# EAGLE schematic olimex10 (EAGLE 6.6.0)

## Sheet 1 of 5
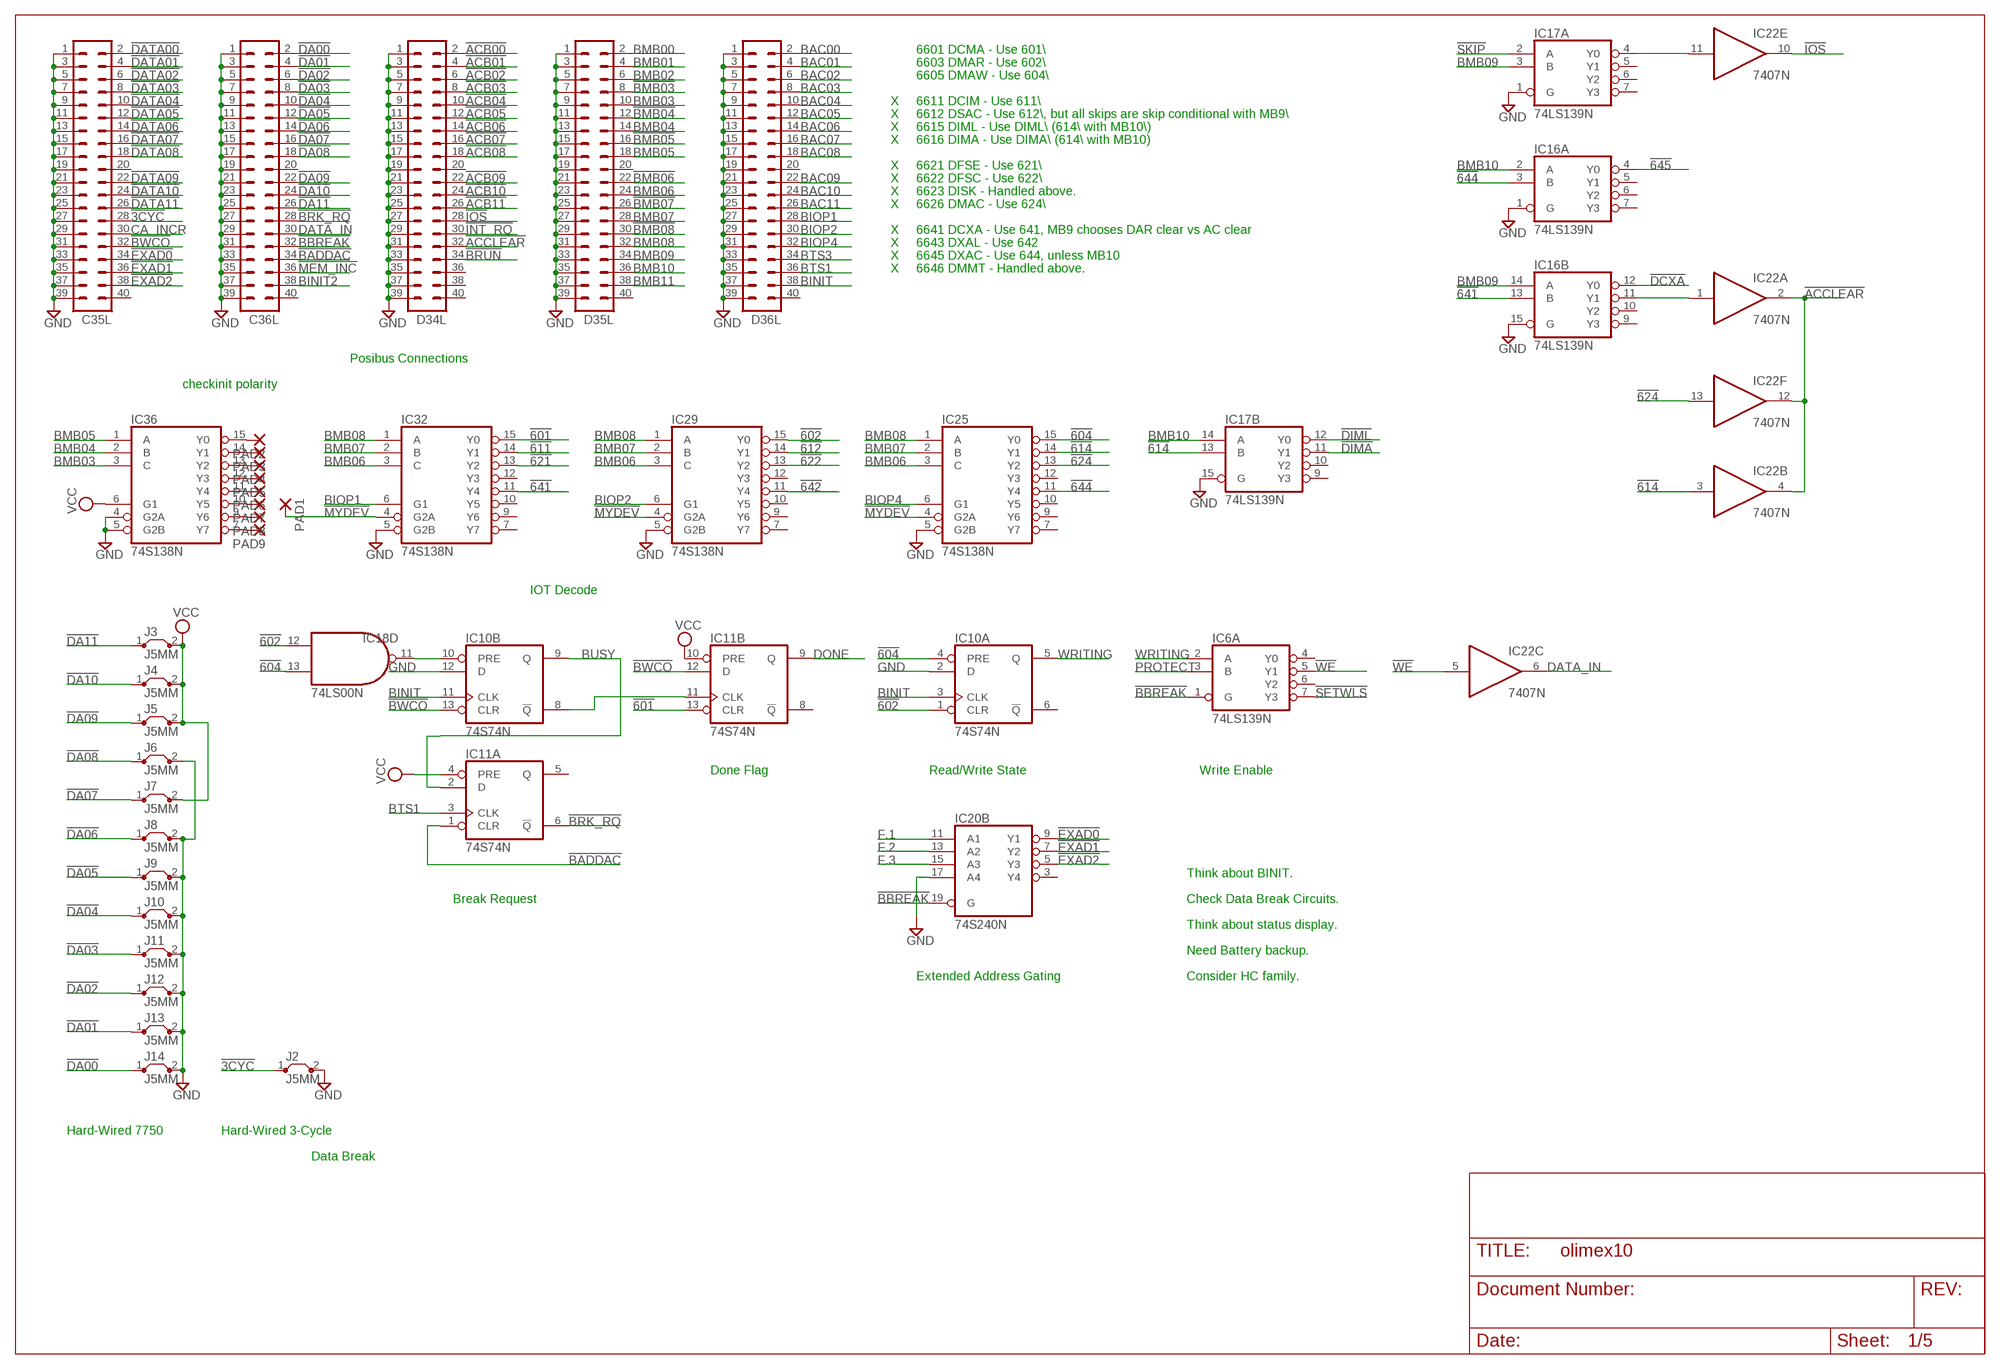
[diagram p0: schematic, sheet 1]

### Parts
C35L  MA20-2  [MA20-2]
C36L  MA20-2  [MA20-2]
D34L  MA20-2  [MA20-2]
D35L  MA20-2  [MA20-2]
D36L  MA20-2  [MA20-2]
IC6  74LS139N  74S139N  [DIL16]
IC10  74S74N  [DIL14]
IC11  74S74N  [DIL14]
IC16  74LS139N  74S139N  [DIL16]
IC17  74LS139N  74S139N  [DIL16]
IC18  74LS00N  [DIL14]
IC20  74S240N  [DIL20]
IC22  7407N  [DIL14]
IC25  74S138N  [DIL16]
IC29  74S138N  [DIL16]
IC32  74S138N  [DIL16]
IC36  74S138N  [DIL16]
J2  J5MM  [05]
J3  J5MM  [05]
J4  J5MM  [05]
J5  J5MM  [05]
J6  J5MM  [05]
J7  J5MM  [05]
J8  J5MM  [05]
J9  J5MM  [05]
J10  J5MM  [05]
J11  J5MM  [05]
J12  J5MM  [05]
J13  J5MM  [05]
J14  J5MM  [05]
PAD1  1,6/0,8  [1,6/0,8]
PAD2  1,6/0,8  [1,6/0,8]
PAD3  1,6/0,8  [1,6/0,8]
PAD4  1,6/0,8  [1,6/0,8]
PAD5  1,6/0,8  [1,6/0,8]
PAD6  1,6/0,8  [1,6/0,8]
PAD7  1,6/0,8  [1,6/0,8]
PAD8  1,6/0,8  [1,6/0,8]
PAD9  1,6/0,8  [1,6/0,8]

### Nets
!3CYC: C35L.28 J2.1
!601: IC11.13(B:CLR) IC32.15(Y0) ; also sheet 2
!602: IC10.1(A:CLR) IC18.12(D:I0) IC29.15(Y0) ; also sheet 2
!604: IC10.4(A:PRE) IC18.13(D:I1) IC25.15(Y0) ; also sheet 2
!611: IC32.14(Y1) ; also sheet 2
!612: IC29.14(Y1) ; also sheet 2
!614: IC17.13(B:B) IC22.3(B:I) IC25.14(Y1)
!621: IC32.13(Y2) ; also sheet 2
!622: IC29.13(Y2) ; also sheet 2
!624: IC22.13(F:I) IC25.13(Y2) ; also sheet 2
!641: IC16.13(B:B) IC32.11(Y4)
!642: IC29.11(Y4) ; also sheet 2
!644: IC16.3(A:B) IC25.11(Y4)
!645: IC16.4(A:Y0) ; also sheet 2
!ACB00: D34L.2 ; also sheet 2
!ACB01: D34L.4 ; also sheet 2
!ACB02: D34L.6 ; also sheet 2
!ACB03: D34L.8 ; also sheet 2
!ACB04: D34L.10 ; also sheet 2
!ACB05: D34L.12 ; also sheet 2
!ACB06: D34L.14 ; also sheet 2
!ACB07: D34L.16 ; also sheet 2
!ACB08: D34L.18 ; also sheet 2
!ACB09: D34L.22 ; also sheet 2
!ACB10: D34L.24 ; also sheet 2
!ACB11: D34L.26 ; also sheet 2
!ACCLEAR: D34L.32 IC22.2(A:O) IC22.4(B:O) IC22.12(F:O)
!BADDAC: C36L.34 IC11.1(A:CLR)
!BBREAK: C36L.32 IC6.1(A:G) IC20.19(B:G) ; also sheet 2,3
!BMB03: D35L.8
!BMB04: D35L.12
!BMB05: D35L.16
!BMB06: D35L.22
!BMB07: D35L.26
!BMB08: D35L.30
!BRK_RQ: C36L.28 IC11.6(A:!Q) ; also sheet 4,5
!BRUN: D34L.34
!BWCO: C35L.32 IC10.13(B:CLR) IC11.12(B:D) ; also sheet 4,5
!DA00: C36L.2 J14.1
!DA01: C36L.4 J13.1
!DA02: C36L.6 J12.1
!DA03: C36L.8 J11.1
!DA04: C36L.10 J10.1
!DA05: C36L.12 J9.1
!DA06: C36L.14 J8.1
!DA07: C36L.16 J7.1
!DA08: C36L.18 J6.1
!DA09: C36L.22 J5.1
!DA10: C36L.24 J4.1
!DA11: C36L.26 J3.1
!DATA00: C35L.2 ; also sheet 3
!DATA01: C35L.4 ; also sheet 3
!DATA02: C35L.6 ; also sheet 3
!DATA03: C35L.8 ; also sheet 3
!DATA04: C35L.10 ; also sheet 3
!DATA05: C35L.12 ; also sheet 3
!DATA06: C35L.14 ; also sheet 3
!DATA07: C35L.16 ; also sheet 3
!DATA08: C35L.18 ; also sheet 3
!DATA09: C35L.22 ; also sheet 3
!DATA10: C35L.24 ; also sheet 3
!DATA11: C35L.26 ; also sheet 3
!DCXA: IC16.12(B:Y0) ; also sheet 2
!DIMA: IC17.11(B:Y1) ; also sheet 2
!DIML: IC17.12(B:Y0) ; also sheet 2
!EXAD0: C35L.34 IC20.9(B:Y1)
!EXAD1: C35L.36 IC20.7(B:Y2)
!EXAD2: C35L.38 IC20.5(B:Y3)
!INT_RQ: D34L.30 ; also sheet 2
!IOS: D34L.28 IC22.10(E:O)
!MEM_INC: C36L.36
!MYDEV: IC25.4(G2A) IC29.4(G2A) IC32.4(G2A) PAD1.1(P)
!SETWLS: IC6.7(A:Y3) ; also sheet 2
!SKIP: IC17.2(A:A) ; also sheet 2
!WE: IC6.5(A:Y1) IC22.5(C:I) ; also sheet 3,4
BAC00: D36L.2 ; also sheet 2
BAC01: D36L.4 ; also sheet 2
BAC02: D36L.6 ; also sheet 2
BAC03: D36L.8 ; also sheet 2
BAC04: D36L.10 ; also sheet 2
BAC05: D36L.12 ; also sheet 2
BAC06: D36L.14 ; also sheet 2
BAC07: D36L.16 ; also sheet 2
BAC08: D36L.18 ; also sheet 2
BAC09: D36L.22 ; also sheet 2
BAC10: D36L.24 ; also sheet 2
BAC11: D36L.26 ; also sheet 2
BINIT: D36L.38 IC10.3(A:CLK) IC10.11(B:CLK) ; also sheet 2
BINIT2: C36L.38
BIOP1: D36L.28 IC32.6(G1)
BIOP2: D36L.30 IC29.6(G1)
BIOP4: D36L.32 IC25.6(G1)
BMB00: D35L.2 ; also sheet 3
BMB01: D35L.4 ; also sheet 3
BMB02: D35L.6 ; also sheet 3
BMB03: D35L.10 IC36.3(C) ; also sheet 3
BMB04: D35L.14 IC36.2(B) ; also sheet 3
BMB05: D35L.18 IC36.1(A) ; also sheet 3
BMB06: D35L.24 IC25.3(C) IC29.3(C) IC32.3(C) ; also sheet 3
BMB07: D35L.28 IC25.2(B) IC29.2(B) IC32.2(B) ; also sheet 3
BMB08: D35L.32 IC25.1(A) IC29.1(A) IC32.1(A) ; also sheet 3
BMB09: D35L.34 IC16.14(B:A) IC17.3(A:B) ; also sheet 3
BMB10: D35L.36 IC16.2(A:A) IC17.14(B:A) ; also sheet 3
BMB11: D35L.38 ; also sheet 3
BTS1: D36L.36 IC11.3(A:CLK)
BTS3: D36L.34
BUSY: IC10.9(B:Q) IC11.2(A:D) ; also sheet 2
CA_INCR: C35L.30
DATA_IN: C36L.30 IC22.6(C:O)
DONE: IC11.9(B:Q) ; also sheet 2,4,5
F.1: IC20.11(B:A1) ; also sheet 2,4,5
F.2: IC20.13(B:A2) ; also sheet 2,4,5
F.3: IC20.15(B:A3) ; also sheet 2,4,5
GND: C35L.1 C35L.3 C35L.5 C35L.7 C35L.9 C35L.11 C35L.13 C35L.15 C35L.17 C35L.19 C35L.21 C35L.23 C35L.25 C35L.27 C35L.29 C35L.31 C35L.33 C35L.35 C35L.37 C35L.39 C36L.1 C36L.3 C36L.5 C36L.7 C36L.9 C36L.11 C36L.13 C36L.15 C36L.17 C36L.19 C36L.21 C36L.23 C36L.25 C36L.27 C36L.29 C36L.31 C36L.33 C36L.35 C36L.37 C36L.39 D34L.1 D34L.3 D34L.5 D34L.7 D34L.9 D34L.11 D34L.13 D34L.15 D34L.17 D34L.19 D34L.21 D34L.23 D34L.25 D34L.27 D34L.29 D34L.31 D34L.33 D34L.35 D34L.37 D34L.39 D35L.1 D35L.3 D35L.5 D35L.7 D35L.9 D35L.11 D35L.13 D35L.15 D35L.17 D35L.19 D35L.21 D35L.23 D35L.25 D35L.27 D35L.29 D35L.31 D35L.33 D35L.35 D35L.37 D35L.39 D36L.1 D36L.3 D36L.5 D36L.7 D36L.9 D36L.11 D36L.13 D36L.15 D36L.17 D36L.19 D36L.21 D36L.23 D36L.25 D36L.27 D36L.29 D36L.31 D36L.33 D36L.35 D36L.37 D36L.39 IC10.2(A:D) IC10.12(B:D) IC16.1(A:G) IC16.15(B:G) IC17.1(A:G) IC17.15(B:G) IC20.17(B:A4) IC25.5(G2B) IC29.5(G2B) IC32.5(G2B) IC36.4(G2A) IC36.5(G2B) J2.2 J6.2 J8.2 J9.2 J10.2 J11.2 J12.2 J13.2 J14.2 ; also sheet 2,3,4,5
N$1: IC36.9(Y6) PAD8.1(P)
N$2: IC10.8(B:!Q) IC11.11(B:CLK)
N$5: IC36.15(Y0) PAD2.1(P)
N$6: IC36.14(Y1) PAD3.1(P)
N$7: IC36.13(Y2) PAD4.1(P)
N$8: IC36.12(Y3) PAD5.1(P)
N$9: IC36.11(Y4) PAD6.1(P)
N$10: IC36.10(Y5) PAD7.1(P)
N$11: IC36.7(Y7) PAD9.1(P)
N$26: IC16.11(B:Y1) IC22.1(A:I)
N$27: IC17.4(A:Y0) IC22.11(E:I)
N$31: IC10.10(B:PRE) IC18.11(D:O)
PROTECT: IC6.3(A:B) ; also sheet 3
VCC [Power]: IC11.4(A:PRE) IC11.10(B:PRE) IC36.6(G1) J3.2 J4.2 J5.2 J7.2 ; also sheet 2,3,4,5
WRITING: IC6.2(A:A) IC10.5(A:Q) ; also sheet 3,4,5
Unconnected: C35L.20 C35L.40 C36L.20 C36L.40 D34L.20 D34L.36 D34L.38 D34L.40 D35L.20 D35L.40 D36L.20 D36L.40 IC6.4(A:Y0) IC6.6(A:Y2) IC6.9(B:Y3) IC6.10(B:Y2) IC6.11(B:Y1) IC6.12(B:Y0) IC6.13(B:B) IC6.14(B:A) IC6.15(B:G) IC10.6(A:!Q) IC11.5(A:Q) IC11.8(B:!Q) IC16.5(A:Y1) IC16.6(A:Y2) IC16.7(A:Y3) IC16.9(B:Y3) IC16.10(B:Y2) IC17.5(A:Y1) IC17.6(A:Y2) IC17.7(A:Y3) IC17.9(B:Y3) IC17.10(B:Y2) IC20.1(A:G) IC20.2(A:A1) IC20.3(B:Y4) IC20.4(A:A2) IC20.6(A:A3) IC20.8(A:A4) IC20.12(A:Y4) IC20.14(A:Y3) IC20.16(A:Y2) IC20.18(A:Y1) IC22.8(D:O) IC22.9(D:I) IC25.7(Y7) IC25.9(Y6) IC25.10(Y5) IC25.12(Y3) IC29.7(Y7) IC29.9(Y6) IC29.10(Y5) IC29.12(Y3) IC32.7(Y7) IC32.9(Y6) IC32.10(Y5) IC32.12(Y3)

### Notes on the sheet
- 6601 DCMA - Use 601\\
- 6603 DMAR - Use 602\\
- 6605 DMAW - Use 604\\
- X | 6611 DCIM - Use 611\\
- X | 6612 DSAC - Use 612\\, but all skips are skip conditional with MB9\\
- X | 6615 DIML - Use DIML\\ (614\\ with MB10\\)
- X | 6616 DIMA - Use DIMA\\ (614\\ with MB10)
- X | 6621 DFSE - Use 621\\
- X | 6622 DFSC - Use 622\\
- X | 6623 DISK - Handled above.
- X | 6626 DMAC - Use 624\\
- X | 6641 DCXA - Use 641, MB9 chooses DAR clear vs AC clear
- X | 6643 DXAL - Use 642
- X | 6645 DXAC - Use 644, unless MB10
- X | 6646 DMMT - Handled above.
- Posibus Connections
- checkinit polarity
- IOT Decode
- Done Flag | Read/Write State | Write Enable
- Think about BINIT.
- Break Request | Check Data Break Circuits.
- Think about status display.
- Need Battery backup.
- Extended Address Gating | Consider HC family.
- Hard-Wired 7750 | Hard-Wired 3-Cycle
- Data Break

## Sheet 2 of 5
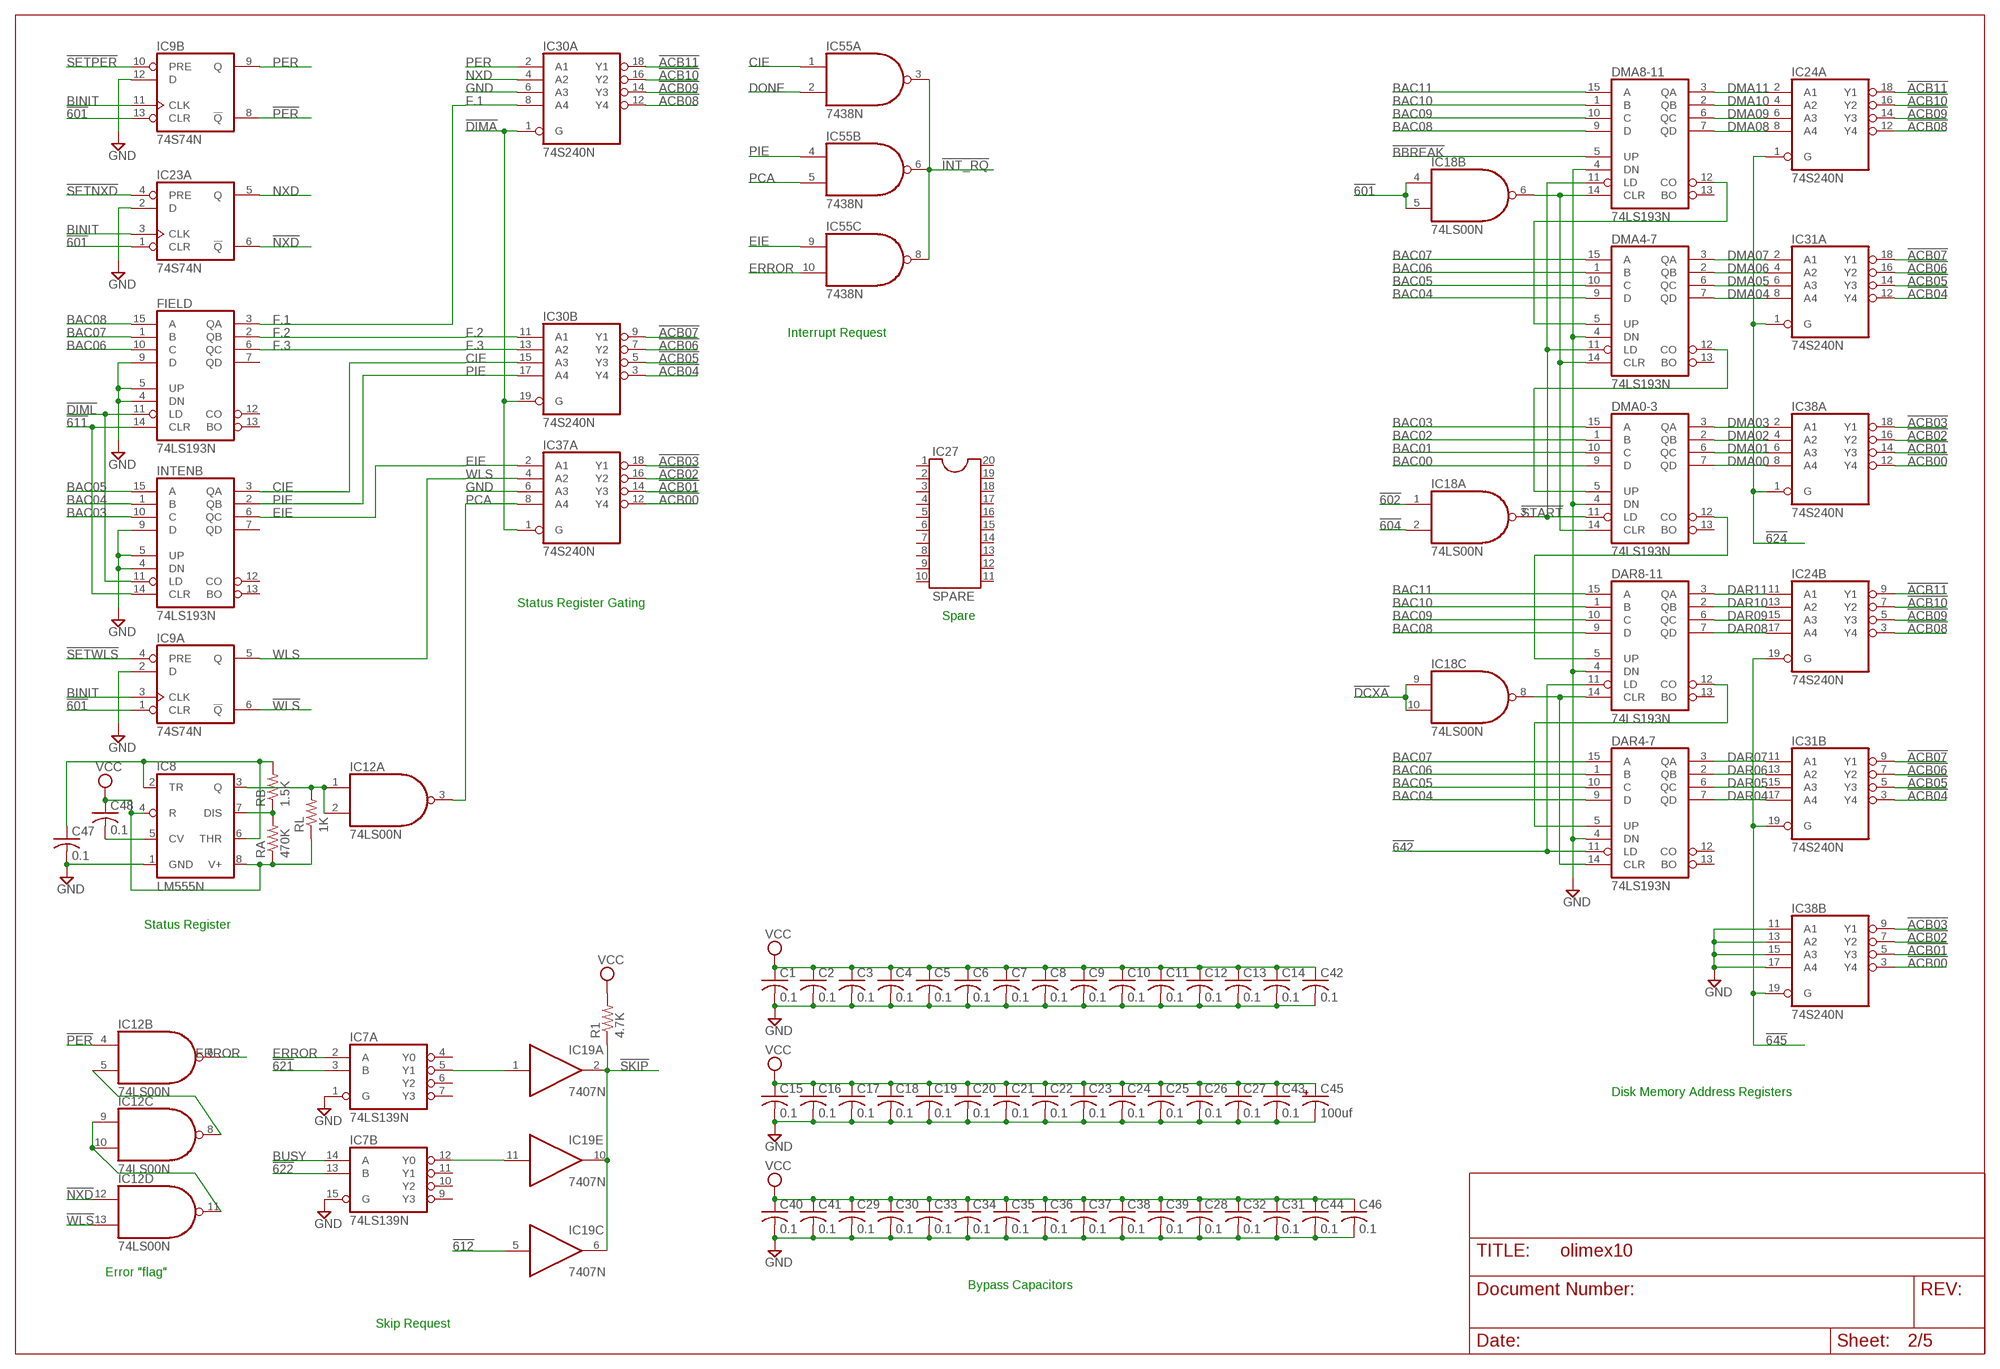
[diagram p1: schematic, sheet 2]

### Parts
C1  0.1  C-US050-025X075  [C050-025X075]
C2  0.1  C-US050-025X075  [C050-025X075]
C3  0.1  C-US050-025X075  [C050-025X075]
C4  0.1  C-US050-025X075  [C050-025X075]
C5  0.1  C-US050-025X075  [C050-025X075]
C6  0.1  C-US050-025X075  [C050-025X075]
C7  0.1  C-US050-025X075  [C050-025X075]
C8  0.1  C-US050-025X075  [C050-025X075]
C9  0.1  C-US050-025X075  [C050-025X075]
C10  0.1  C-US050-025X075  [C050-025X075]
C11  0.1  C-US050-025X075  [C050-025X075]
C12  0.1  C-US050-025X075  [C050-025X075]
C13  0.1  C-US050-025X075  [C050-025X075]
C14  0.1  C-US050-025X075  [C050-025X075]
C15  0.1  C-US050-025X075  [C050-025X075]
C16  0.1  C-US050-025X075  [C050-025X075]
C17  0.1  C-US050-025X075  [C050-025X075]
C18  0.1  C-US050-025X075  [C050-025X075]
C19  0.1  C-US050-025X075  [C050-025X075]
C20  0.1  C-US050-025X075  [C050-025X075]
C21  0.1  C-US050-025X075  [C050-025X075]
C22  0.1  C-US050-025X075  [C050-025X075]
C23  0.1  C-US050-025X075  [C050-025X075]
C24  0.1  C-US050-025X075  [C050-025X075]
C25  0.1  C-US050-025X075  [C050-025X075]
C26  0.1  C-US050-025X075  [C050-025X075]
C27  0.1  C-US050-025X075  [C050-025X075]
C28  0.1  C-US050-025X075  [C050-025X075]
C29  0.1  C-US050-025X075  [C050-025X075]
C30  0.1  C-US050-025X075  [C050-025X075]
C31  0.1  C-US050-025X075  [C050-025X075]
C32  0.1  C-US050-025X075  [C050-025X075]
C33  0.1  C-US050-025X075  [C050-025X075]
C34  0.1  C-US050-025X075  [C050-025X075]
C35  0.1  C-US050-025X075  [C050-025X075]
C36  0.1  C-US050-025X075  [C050-025X075]
C37  0.1  C-US050-025X075  [C050-025X075]
C38  0.1  C-US050-025X075  [C050-025X075]
C39  0.1  C-US050-025X075  [C050-025X075]
C40  0.1  C-US050-025X075  [C050-025X075]
C41  0.1  C-US050-025X075  [C050-025X075]
C42  0.1  C-US050-025X075  [C050-025X075]
C43  0.1  C-US050-025X075  [C050-025X075]
C44  0.1  C-US050-025X075  [C050-025X075]
C45  100uf  CPOL-USE22-6AXIAL  [E22-6]
C46  0.1  C-US050-025X075  [C050-025X075]
C47  0.1  C-US050-025X075  [C050-025X075]
C48  0.1  C-US050-025X075  [C050-025X075]
DAR4-7  74LS193N  74LS192N  [DIL16]
DAR8-11  74LS193N  74LS192N  [DIL16]
DMA0-3  74LS193N  74LS192N  [DIL16]
DMA4-7  74LS193N  74LS192N  [DIL16]
DMA8-11  74LS193N  74LS192N  [DIL16]
FIELD  74LS193N  74LS192N  [DIL16]
IC7  74LS139N  [DIL16]
IC8  LM555N  [DIL08]
IC9  74S74N  [DIL14]
IC12  74LS00N  [DIL14]
IC19  7407N  [DIL14]
IC23  74S74N  [DIL14]
IC24  74S240N  [DIL20]
IC27  SPARE  DIL20  [DIL20]
IC30  74S240N  [DIL20]
IC31  74S240N  [DIL20]
IC37  74S240N  [DIL20]
IC38  74S240N  [DIL20]
IC55  7438N  [DIL14]
INTENB  74LS193N  74LS192N  [DIL16]
R1  4.7K  R-US_0207/10  [0207/10]
RA  470K  R-US_0207/10  [0207/10]
RB  1.5K  R-US_0207/10  [0207/10]
RL  1K  R-US_0207/10  [0207/10]

### Nets
!601: IC9.1(A:CLR) IC9.13(B:CLR) IC18.4(B:I0) IC18.5(B:I1) IC23.1(A:CLR) ; also sheet 1
!602: IC18.1(A:I0) ; also sheet 1
!604: IC18.2(A:I1) ; also sheet 1
!611: FIELD.14(CLR) INTENB.14(CLR) ; also sheet 1
!612: IC19.5(C:I) ; also sheet 1
!621: IC7.3(A:B) ; also sheet 1
!622: IC7.13(B:B) ; also sheet 1
!624: IC24.1(A:G) IC31.1(A:G) IC38.1(A:G) ; also sheet 1
!642: DAR4-7.11(LD) DAR8-11.11(LD) ; also sheet 1
!645: IC24.19(B:G) IC31.19(B:G) IC38.19(B:G) ; also sheet 1
!ACB00: IC37.12(A:Y4) IC38.3(B:Y4) IC38.12(A:Y4) ; also sheet 1
!ACB01: IC37.14(A:Y3) IC38.5(B:Y3) IC38.14(A:Y3) ; also sheet 1
!ACB02: IC37.16(A:Y2) IC38.7(B:Y2) IC38.16(A:Y2) ; also sheet 1
!ACB03: IC37.18(A:Y1) IC38.9(B:Y1) IC38.18(A:Y1) ; also sheet 1
!ACB04: IC30.3(B:Y4) IC31.3(B:Y4) IC31.12(A:Y4) ; also sheet 1
!ACB05: IC30.5(B:Y3) IC31.5(B:Y3) IC31.14(A:Y3) ; also sheet 1
!ACB06: IC30.7(B:Y2) IC31.7(B:Y2) IC31.16(A:Y2) ; also sheet 1
!ACB07: IC30.9(B:Y1) IC31.9(B:Y1) IC31.18(A:Y1) ; also sheet 1
!ACB08: IC24.3(B:Y4) IC24.12(A:Y4) IC30.12(A:Y4) ; also sheet 1
!ACB09: IC24.5(B:Y3) IC24.14(A:Y3) IC30.14(A:Y3) ; also sheet 1
!ACB10: IC24.7(B:Y2) IC24.16(A:Y2) IC30.16(A:Y2) ; also sheet 1
!ACB11: IC24.9(B:Y1) IC24.18(A:Y1) IC30.18(A:Y1) ; also sheet 1
!BBREAK: DMA8-11.5(UP) ; also sheet 1,3
!DCXA: IC18.9(C:I0) IC18.10(C:I1) ; also sheet 1
!DIMA: IC30.1(A:G) IC30.19(B:G) IC37.1(A:G) ; also sheet 1
!DIML: FIELD.11(LD) INTENB.11(LD) ; also sheet 1
!INT_RQ: IC55.3(A:O) IC55.6(B:O) IC55.8(C:O) ; also sheet 1
!NXD: IC12.12(D:I0) IC23.6(A:!Q)
!PER: IC9.8(B:!Q) IC12.4(B:I0)
!SETNXD: IC23.4(A:PRE) ; also sheet 3
!SETPER: IC9.10(B:PRE) ; also sheet 3
!SETWLS: IC9.4(A:PRE) ; also sheet 1
!SKIP: IC19.2(A:O) IC19.6(C:O) IC19.10(E:O) R1.1 ; also sheet 1
!START: DMA0-3.11(LD) DMA4-7.11(LD) DMA8-11.11(LD) IC18.3(A:O)
!WLS: IC9.6(A:!Q) IC12.13(D:I1)
BAC00: DMA0-3.9(D) ; also sheet 1
BAC01: DMA0-3.10(C) ; also sheet 1
BAC02: DMA0-3.1(B) ; also sheet 1
BAC03: DMA0-3.15(A) INTENB.10(C) ; also sheet 1
BAC04: DAR4-7.9(D) DMA4-7.9(D) INTENB.1(B) ; also sheet 1
BAC05: DAR4-7.10(C) DMA4-7.10(C) INTENB.15(A) ; also sheet 1
BAC06: DAR4-7.1(B) DMA4-7.1(B) FIELD.10(C) ; also sheet 1
BAC07: DAR4-7.15(A) DMA4-7.15(A) FIELD.1(B) ; also sheet 1
BAC08: DAR8-11.9(D) DMA8-11.9(D) FIELD.15(A) ; also sheet 1
BAC09: DAR8-11.10(C) DMA8-11.10(C) ; also sheet 1
BAC10: DAR8-11.1(B) DMA8-11.1(B) ; also sheet 1
BAC11: DAR8-11.15(A) DMA8-11.15(A) ; also sheet 1
BINIT: IC9.3(A:CLK) IC9.11(B:CLK) IC23.3(A:CLK) ; also sheet 1
BUSY: IC7.14(B:A) ; also sheet 1
CIE: IC30.15(B:A3) IC55.1(A:I0) INTENB.3(QA) ; also sheet 4,5
DAR04: DAR4-7.7(QD) IC31.17(B:A4) ; also sheet 3,4,5
DAR05: DAR4-7.6(QC) IC31.15(B:A3) ; also sheet 3,4,5
DAR06: DAR4-7.2(QB) IC31.13(B:A2) ; also sheet 3,4,5
DAR07: DAR4-7.3(QA) IC31.11(B:A1) ; also sheet 3,4,5
DAR08: DAR8-11.7(QD) IC24.17(B:A4) ; also sheet 3,4,5
DAR09: DAR8-11.6(QC) IC24.15(B:A3) ; also sheet 3,4,5
DAR10: DAR8-11.2(QB) IC24.13(B:A2) ; also sheet 3,4,5
DAR11: DAR8-11.3(QA) IC24.11(B:A1) ; also sheet 3,4,5
DMA00: DMA0-3.7(QD) IC38.8(A:A4) ; also sheet 3,4,5
DMA01: DMA0-3.6(QC) IC38.6(A:A3) ; also sheet 3,4,5
DMA02: DMA0-3.2(QB) IC38.4(A:A2) ; also sheet 3,4,5
DMA03: DMA0-3.3(QA) IC38.2(A:A1) ; also sheet 3,4,5
DMA04: DMA4-7.7(QD) IC31.8(A:A4) ; also sheet 3,4,5
DMA05: DMA4-7.6(QC) IC31.6(A:A3) ; also sheet 3,4,5
DMA06: DMA4-7.2(QB) IC31.4(A:A2) ; also sheet 3,4,5
DMA07: DMA4-7.3(QA) IC31.2(A:A1) ; also sheet 3,4,5
DMA08: DMA8-11.7(QD) IC24.8(A:A4) ; also sheet 3,4,5
DMA09: DMA8-11.6(QC) IC24.6(A:A3) ; also sheet 3,4,5
DMA10: DMA8-11.2(QB) IC24.4(A:A2) ; also sheet 3,4,5
DMA11: DMA8-11.3(QA) IC24.2(A:A1) ; also sheet 3,4,5
DONE: IC55.2(A:I1) ; also sheet 1,4,5
EIE: IC37.2(A:A1) IC55.9(C:I0) INTENB.6(QC) ; also sheet 4,5
ERROR: IC7.2(A:A) IC12.6(B:O) IC55.10(C:I1)
F.1: FIELD.3(QA) IC30.8(A:A4) ; also sheet 1,4,5
F.2: FIELD.2(QB) IC30.11(B:A1) ; also sheet 1,4,5
F.3: FIELD.6(QC) IC30.13(B:A2) ; also sheet 1,4,5
GND: C1.2 C2.2 C3.2 C4.2 C5.2 C6.2 C7.2 C8.2 C9.2 C10.2 C11.2 C12.2 C13.2 C14.2 C15.2 C16.2 C17.2 C18.2 C19.2 C20.2 C21.2 C22.2 C23.2 C24.2 C25.2 C26.2 C27.2 C28.2 C29.2 C30.2 C31.2 C32.2 C33.2 C34.2 C35.2 C36.2 C37.2 C38.2 C39.2 C40.2 C41.2 C42.2 C43.2 C44.2 C45.- C46.2 C47.2 DAR4-7.4(DN) DAR8-11.4(DN) DMA0-3.4(DN) DMA4-7.4(DN) DMA8-11.4(DN) FIELD.4(DN) FIELD.5(UP) FIELD.9(D) IC7.1(A:G) IC7.15(B:G) IC8.1(GND) IC9.2(A:D) IC9.12(B:D) IC23.2(A:D) IC30.6(A:A3) IC37.6(A:A3) IC38.11(B:A1) IC38.13(B:A2) IC38.15(B:A3) IC38.17(B:A4) INTENB.4(DN) INTENB.5(UP) INTENB.9(D) ; also sheet 1,3,4,5
N$3: DMA0-3.5(UP) DMA4-7.12(CO)
N$12: DAR4-7.14(CLR) DAR8-11.14(CLR) IC18.8(C:O)
N$13: DMA4-7.5(UP) DMA8-11.12(CO)
N$16: DAR8-11.5(UP) DMA0-3.12(CO)
N$22: DMA0-3.14(CLR) DMA4-7.14(CLR) DMA8-11.14(CLR) IC18.6(B:O)
N$25: DAR4-7.5(UP) DAR8-11.12(CO)
N$28: IC7.5(A:Y1) IC19.1(A:I)
N$29: IC8.7(DIS) RA.2 RB.1
N$30: IC8.3(Q) IC12.1(A:I0) IC12.2(A:I1) RL.2
N$32: C47.1 IC8.2(TR) IC8.6(THR) RB.2
N$33: IC7.12(B:Y0) IC19.11(E:I)
N$34: C48.2 IC8.5(CV)
N$37: IC12.9(C:I0) IC12.10(C:I1) IC12.11(D:O)
N$40: IC12.5(B:I1) IC12.8(C:O)
NXD: IC23.5(A:Q) IC30.4(A:A2) ; also sheet 4,5
PCA: IC12.3(A:O) IC37.8(A:A4) IC55.5(B:I1)
PER: IC9.9(B:Q) IC30.2(A:A1) ; also sheet 4,5
PIE: IC30.17(B:A4) IC55.4(B:I0) INTENB.2(QB) ; also sheet 4,5
VCC [Power]: C1.1 C2.1 C3.1 C4.1 C5.1 C6.1 C7.1 C8.1 C9.1 C10.1 C11.1 C12.1 C13.1 C14.1 C15.1 C16.1 C17.1 C18.1 C19.1 C20.1 C21.1 C22.1 C23.1 C24.1 C25.1 C26.1 C27.1 C28.1 C29.1 C30.1 C31.1 C32.1 C33.1 C34.1 C35.1 C36.1 C37.1 C38.1 C39.1 C40.1 C41.1 C42.1 C43.1 C44.1 C45.+ C46.1 C48.1 IC8.4(R) IC8.8(V+) R1.2 RA.1 RL.1 ; also sheet 1,3,4,5
WLS: IC9.5(A:Q) IC37.4(A:A2) ; also sheet 4,5
Unconnected: DAR4-7.12(CO) DAR4-7.13(BO) DAR8-11.13(BO) DMA0-3.13(BO) DMA4-7.13(BO) DMA8-11.13(BO) FIELD.7(QD) FIELD.12(CO) FIELD.13(BO) IC7.4(A:Y0) IC7.6(A:Y2) IC7.7(A:Y3) IC7.9(B:Y3) IC7.10(B:Y2) IC7.11(B:Y1) IC19.3(B:I) IC19.4(B:O) IC19.8(D:O) IC19.9(D:I) IC19.12(F:O) IC19.13(F:I) IC23.8(B:!Q) IC23.9(B:Q) IC23.10(B:PRE) IC23.11(B:CLK) IC23.12(B:D) IC23.13(B:CLR) IC27.1 IC27.2 IC27.3 IC27.4 IC27.5 IC27.6 IC27.7 IC27.8 IC27.9 IC27.10 IC27.11 IC27.12 IC27.13 IC27.14 IC27.15 IC27.16 IC27.17 IC27.18 IC27.19 IC27.20 IC37.3(B:Y4) IC37.5(B:Y3) IC37.7(B:Y2) IC37.9(B:Y1) IC37.11(B:A1) IC37.13(B:A2) IC37.15(B:A3) IC37.17(B:A4) IC37.19(B:G) IC55.11(D:O) IC55.12(D:I0) IC55.13(D:I1) INTENB.7(QD) INTENB.12(CO) INTENB.13(BO)

### Notes on the sheet
- Interrupt Request
- Status Register Gating
- Spare
- Status Register
- Disk Memory Address Registers
- Error "flag"
- Bypass Capacitors
- Skip Request

## Sheet 3 of 5
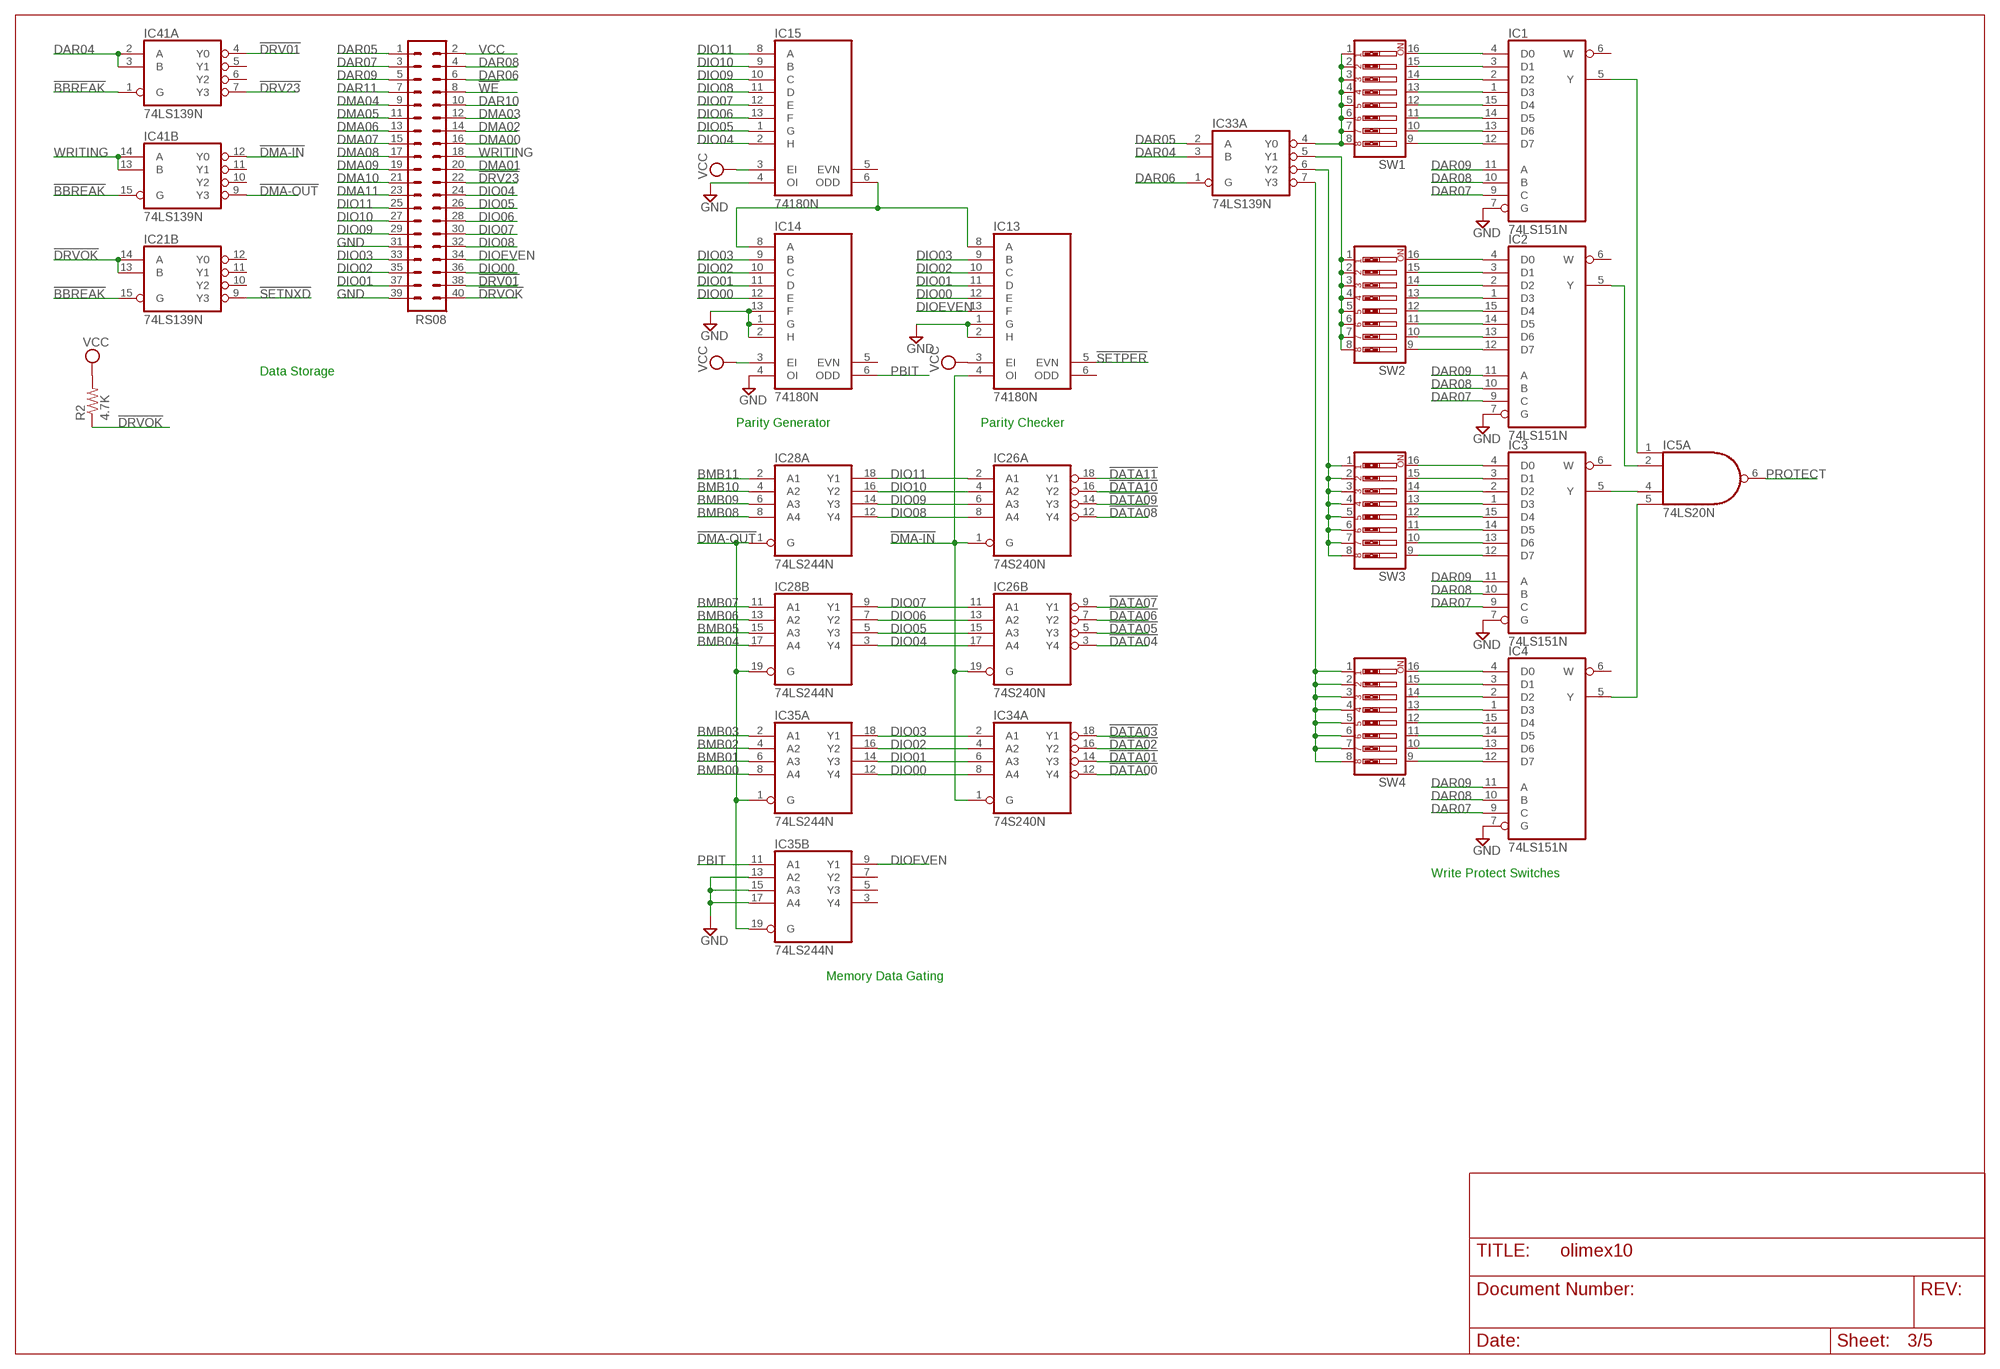
[diagram p2: schematic, sheet 3]

### Parts
IC1  74LS151N  [DIL16]
IC2  74LS151N  [DIL16]
IC3  74LS151N  [DIL16]
IC4  74LS151N  [DIL16]
IC5  74LS20N  [DIL14]
IC13  74180N  [DIL14]
IC14  74180N  [DIL14]
IC15  74180N  [DIL14]
IC21  74LS139N  [DIL16]
IC26  74S240N  [DIL20]
IC28  74LS244N  [DIL20]
IC33  74LS139N  [DIL16]
IC34  74S240N  [DIL20]
IC35  74LS244N  [DIL20]
IC41  74LS139N  [DIL16]
R2  4.7K  R-US_0207/10  [0207/10]
RS08  MA20-2  [MA20-2]
SW1  SW_DIP-8  [EDG-08]
SW2  SW_DIP-8  [EDG-08]
SW3  SW_DIP-8  [EDG-08]
SW4  SW_DIP-8  [EDG-08]

### Nets
!BBREAK: IC21.15(B:G) IC41.1(A:G) IC41.15(B:G) ; also sheet 1,2
!DATA00: IC34.12(A:Y4) ; also sheet 1
!DATA01: IC34.14(A:Y3) ; also sheet 1
!DATA02: IC34.16(A:Y2) ; also sheet 1
!DATA03: IC34.18(A:Y1) ; also sheet 1
!DATA04: IC26.3(B:Y4) ; also sheet 1
!DATA05: IC26.5(B:Y3) ; also sheet 1
!DATA06: IC26.7(B:Y2) ; also sheet 1
!DATA07: IC26.9(B:Y1) ; also sheet 1
!DATA08: IC26.12(A:Y4) ; also sheet 1
!DATA09: IC26.14(A:Y3) ; also sheet 1
!DATA10: IC26.16(A:Y2) ; also sheet 1
!DATA11: IC26.18(A:Y1) ; also sheet 1
!DMA-IN: IC13.4(OI) IC26.1(A:G) IC26.19(B:G) IC34.1(A:G) IC41.12(B:Y0)
!DMA-OUT: IC28.1(A:G) IC28.19(B:G) IC35.1(A:G) IC35.19(B:G) IC41.9(B:Y3)
!DRV01: IC41.4(A:Y0) RS08.38 ; also sheet 4
!DRV23: IC41.7(A:Y3) RS08.22 ; also sheet 4
!DRVOK: IC21.13(B:B) IC21.14(B:A) R2.1 RS08.40 ; also sheet 4
!SETNXD: IC21.9(B:Y3) ; also sheet 2
!SETPER: IC13.5(EVN) ; also sheet 2
!WE: RS08.8 ; also sheet 1,4
BMB00: IC35.8(A:A4) ; also sheet 1
BMB01: IC35.6(A:A3) ; also sheet 1
BMB02: IC35.4(A:A2) ; also sheet 1
BMB03: IC35.2(A:A1) ; also sheet 1
BMB04: IC28.17(B:A4) ; also sheet 1
BMB05: IC28.15(B:A3) ; also sheet 1
BMB06: IC28.13(B:A2) ; also sheet 1
BMB07: IC28.11(B:A1) ; also sheet 1
BMB08: IC28.8(A:A4) ; also sheet 1
BMB09: IC28.6(A:A3) ; also sheet 1
BMB10: IC28.4(A:A2) ; also sheet 1
BMB11: IC28.2(A:A1) ; also sheet 1
DAR04: IC33.3(A:B) IC41.2(A:A) IC41.3(A:B) ; also sheet 2,4,5
DAR05: IC33.2(A:A) RS08.1 ; also sheet 2,4,5
DAR06: IC33.1(A:G) RS08.6 ; also sheet 2,4,5
DAR07: IC1.9(C) IC2.9(C) IC3.9(C) IC4.9(C) RS08.3 ; also sheet 2,4,5
DAR08: IC1.10(B) IC2.10(B) IC3.10(B) IC4.10(B) RS08.4 ; also sheet 2,4,5
DAR09: IC1.11(A) IC2.11(A) IC3.11(A) IC4.11(A) RS08.5 ; also sheet 2,4,5
DAR10: RS08.10 ; also sheet 2,4,5
DAR11: RS08.7 ; also sheet 2,4,5
DIO00: IC13.12(E) IC14.12(E) IC34.8(A:A4) IC35.12(A:Y4) RS08.36 ; also sheet 4,5
DIO01: IC13.11(D) IC14.11(D) IC34.6(A:A3) IC35.14(A:Y3) RS08.37 ; also sheet 4,5
DIO02: IC13.10(C) IC14.10(C) IC34.4(A:A2) IC35.16(A:Y2) RS08.35 ; also sheet 4,5
DIO03: IC13.9(B) IC14.9(B) IC34.2(A:A1) IC35.18(A:Y1) RS08.33 ; also sheet 4,5
DIO04: IC15.2(H) IC26.17(B:A4) IC28.3(B:Y4) RS08.24 ; also sheet 4,5
DIO05: IC15.1(G) IC26.15(B:A3) IC28.5(B:Y3) RS08.26 ; also sheet 4,5
DIO06: IC15.13(F) IC26.13(B:A2) IC28.7(B:Y2) RS08.28 ; also sheet 4,5
DIO07: IC15.12(E) IC26.11(B:A1) IC28.9(B:Y1) RS08.30 ; also sheet 4,5
DIO08: IC15.11(D) IC26.8(A:A4) IC28.12(A:Y4) RS08.32 ; also sheet 4,5
DIO09: IC15.10(C) IC26.6(A:A3) IC28.14(A:Y3) RS08.29 ; also sheet 4,5
DIO10: IC15.9(B) IC26.4(A:A2) IC28.16(A:Y2) RS08.27 ; also sheet 4,5
DIO11: IC15.8(A) IC26.2(A:A1) IC28.18(A:Y1) RS08.25 ; also sheet 4,5
DIOEVEN: IC13.13(F) IC35.9(B:Y1) RS08.34 ; also sheet 4
DMA00: RS08.16 ; also sheet 2,4,5
DMA01: RS08.20 ; also sheet 2,4,5
DMA02: RS08.14 ; also sheet 2,4,5
DMA03: RS08.12 ; also sheet 2,4,5
DMA04: RS08.9 ; also sheet 2,4,5
DMA05: RS08.11 ; also sheet 2,4,5
DMA06: RS08.13 ; also sheet 2,4,5
DMA07: RS08.15 ; also sheet 2,4,5
DMA08: RS08.17 ; also sheet 2,4,5
DMA09: RS08.19 ; also sheet 2,4,5
DMA10: RS08.21 ; also sheet 2,4,5
DMA11: RS08.23 ; also sheet 2,4,5
GND: IC1.7(G) IC2.7(G) IC3.7(G) IC4.7(G) IC13.1(G) IC13.2(H) IC14.1(G) IC14.2(H) IC14.4(OI) IC14.13(F) IC15.4(OI) IC35.13(B:A2) IC35.15(B:A3) IC35.17(B:A4) RS08.31 RS08.39 ; also sheet 1,2,4,5
N$4: IC33.4(A:Y0) SW1.1 SW1.2 SW1.3 SW1.4 SW1.5 SW1.6 SW1.7 SW1.8
N$14: IC13.8(A) IC14.8(A) IC15.6(ODD)
N$15: IC2.5(Y) IC5.2(A:I1)
N$17: IC33.5(A:Y1) SW2.1 SW2.2 SW2.3 SW2.4 SW2.5 SW2.6 SW2.7 SW2.8
N$19: IC33.6(A:Y2) SW3.1 SW3.2 SW3.3 SW3.4 SW3.5 SW3.6 SW3.7 SW3.8
N$20: IC33.7(A:Y3) SW4.1 SW4.2 SW4.3 SW4.4 SW4.5 SW4.6 SW4.7 SW4.8
N$21: IC3.5(Y) IC5.4(A:I2)
N$23: IC1.5(Y) IC5.1(A:I0)
N$24: IC4.5(Y) IC5.5(A:I3)
N$53: IC1.4(D0) SW1.16
N$54: IC1.3(D1) SW1.15
N$55: IC1.2(D2) SW1.14
N$56: IC1.1(D3) SW1.13
N$57: IC1.14(D5) SW1.11
N$58: IC1.13(D6) SW1.10
N$59: IC1.12(D7) SW1.9
N$60: IC1.15(D4) SW1.12
N$61: IC2.4(D0) SW2.16
N$62: IC2.3(D1) SW2.15
N$63: IC2.2(D2) SW2.14
N$64: IC2.1(D3) SW2.13
N$65: IC2.14(D5) SW2.11
N$66: IC2.13(D6) SW2.10
N$67: IC2.12(D7) SW2.9
N$68: IC3.4(D0) SW3.16
N$69: IC3.3(D1) SW3.15
N$70: IC3.2(D2) SW3.14
N$71: IC3.1(D3) SW3.13
N$72: IC3.14(D5) SW3.11
N$73: IC3.13(D6) SW3.10
N$74: IC3.12(D7) SW3.9
N$75: IC4.4(D0) SW4.16
N$76: IC4.3(D1) SW4.15
N$77: IC4.2(D2) SW4.14
N$78: IC4.1(D3) SW4.13
N$79: IC4.14(D5) SW4.11
N$80: IC4.13(D6) SW4.10
N$81: IC4.12(D7) SW4.9
N$82: IC4.15(D4) SW4.12
N$83: IC3.15(D4) SW3.12
N$84: IC2.15(D4) SW2.12
PBIT: IC14.6(ODD) IC35.11(B:A1)
PROTECT: IC5.6(A:O) ; also sheet 1
VCC [Power]: IC13.3(EI) IC14.3(EI) IC15.3(EI) R2.2 RS08.2 ; also sheet 1,2,4,5
WRITING: IC41.13(B:B) IC41.14(B:A) RS08.18 ; also sheet 1,4,5
Unconnected: IC1.6(W) IC2.6(W) IC3.6(W) IC4.6(W) IC5.8(B:O) IC5.9(B:I0) IC5.10(B:I1) IC5.12(B:I2) IC5.13(B:I3) IC13.6(ODD) IC14.5(EVN) IC15.5(EVN) IC21.1(A:G) IC21.2(A:A) IC21.3(A:B) IC21.4(A:Y0) IC21.5(A:Y1) IC21.6(A:Y2) IC21.7(A:Y3) IC21.10(B:Y2) IC21.11(B:Y1) IC21.12(B:Y0) IC33.9(B:Y3) IC33.10(B:Y2) IC33.11(B:Y1) IC33.12(B:Y0) IC33.13(B:B) IC33.14(B:A) IC33.15(B:G) IC34.3(B:Y4) IC34.5(B:Y3) IC34.7(B:Y2) IC34.9(B:Y1) IC34.11(B:A1) IC34.13(B:A2) IC34.15(B:A3) IC34.17(B:A4) IC34.19(B:G) IC35.3(B:Y4) IC35.5(B:Y3) IC35.7(B:Y2) IC41.5(A:Y1) IC41.6(A:Y2) IC41.10(B:Y2) IC41.11(B:Y1)

### Notes on the sheet
- Data Storage
- Parity Generator | Parity Checker
- Write Protect Switches
- Memory Data Gating

## Sheet 4 of 5
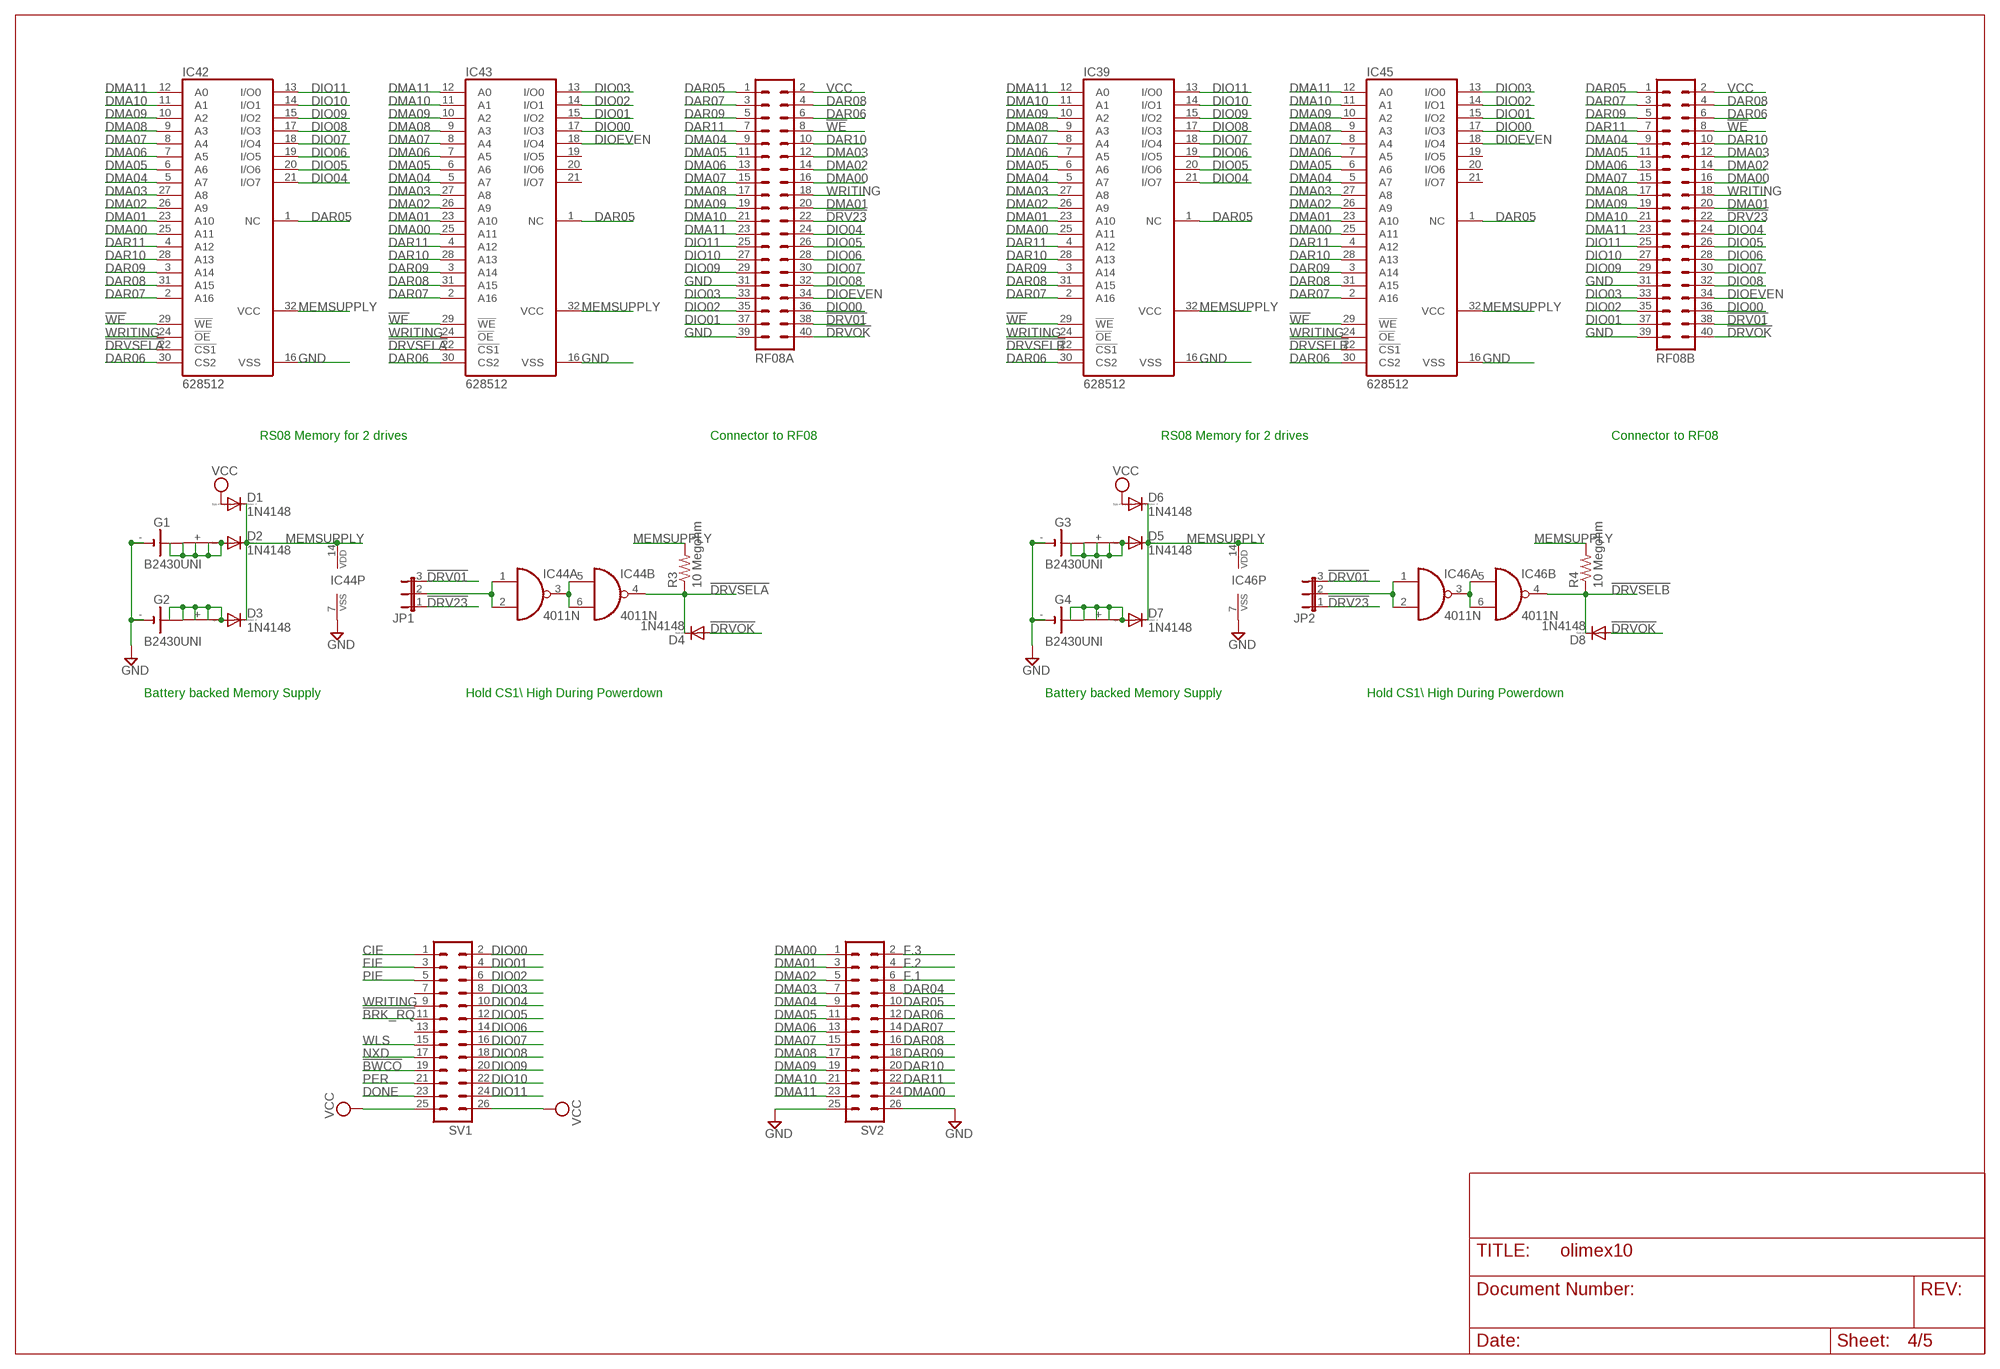
[diagram p3: schematic, sheet 4]

### Parts
D1  1N4148  1N4148DO35-10  [DO35-10]
D2  1N4148  1N4148DO35-10  [DO35-10]
D3  1N4148  1N4148DO35-10  [DO35-10]
D4  1N4148  1N4148DO35-10  [DO35-10]
D5  1N4148  1N4148DO35-10  [DO35-10]
D6  1N4148  1N4148DO35-10  [DO35-10]
D7  1N4148  1N4148DO35-10  [DO35-10]
D8  1N4148  1N4148DO35-10  [DO35-10]
G1  B2430UNI  [B2430UNI]
G2  B2430UNI  [B2430UNI]
G3  B2430UNI  [B2430UNI]
G4  B2430UNI  [B2430UNI]
IC39  628512  628128P  [DIL32]
IC42  628512  628128P  [DIL32]
IC43  628512  628128P  [DIL32]
IC44  4011N  [DIL14]
IC45  628512  628128P  [DIL32]
IC46  4011N  [DIL14]
JP1  JP2E  [JP2]
JP2  JP2E  [JP2]
R3  10 Megohm  R-US_0207/10  [0207/10]
R4  10 Megohm  R-US_0207/10  [0207/10]
RF08A  MA20-2  [MA20-2]
RF08B  MA20-2  [MA20-2]
SV1  MA13-2  [MA13-2]
SV2  MA13-2  [MA13-2]

### Nets
!BRK_RQ: SV1.11 ; also sheet 1,5
!BWCO: SV1.19 ; also sheet 1,5
!DRV01: JP1.3 JP2.3 RF08A.38 RF08B.38 ; also sheet 3
!DRV23: JP1.1 JP2.1 RF08A.22 RF08B.22 ; also sheet 3
!DRVOK: D4.A D8.A RF08A.40 RF08B.40 ; also sheet 3
!DRVSELA: D4.C IC42.22(!CS1) IC43.22(!CS1) IC44.4(B:O) R3.1
!DRVSELB: D8.C IC39.22(!CS1) IC45.22(!CS1) IC46.4(B:O) R4.1
!WE: IC39.29(!WE) IC42.29(!WE) IC43.29(!WE) IC45.29(!WE) RF08A.8 RF08B.8 ; also sheet 1,3
CIE: SV1.1 ; also sheet 2,5
DAR04: SV2.8 ; also sheet 2,3,5
DAR05: IC39.1(NC) IC42.1(NC) IC43.1(NC) IC45.1(NC) RF08A.1 RF08B.1 SV2.10 ; also sheet 2,3,5
DAR06: IC39.30(CS2) IC42.30(CS2) IC43.30(CS2) IC45.30(CS2) RF08A.6 RF08B.6 SV2.12 ; also sheet 2,3,5
DAR07: IC39.2(A16) IC42.2(A16) IC43.2(A16) IC45.2(A16) RF08A.3 RF08B.3 SV2.14 ; also sheet 2,3,5
DAR08: IC39.31(A15) IC42.31(A15) IC43.31(A15) IC45.31(A15) RF08A.4 RF08B.4 SV2.16 ; also sheet 2,3,5
DAR09: IC39.3(A14) IC42.3(A14) IC43.3(A14) IC45.3(A14) RF08A.5 RF08B.5 SV2.18 ; also sheet 2,3,5
DAR10: IC39.28(A13) IC42.28(A13) IC43.28(A13) IC45.28(A13) RF08A.10 RF08B.10 SV2.20 ; also sheet 2,3,5
DAR11: IC39.4(A12) IC42.4(A12) IC43.4(A12) IC45.4(A12) RF08A.7 RF08B.7 SV2.22 ; also sheet 2,3,5
DIO00: IC43.17(I/O3) IC45.17(I/O3) RF08A.36 RF08B.36 SV1.2 ; also sheet 3,5
DIO01: IC43.15(I/O2) IC45.15(I/O2) RF08A.37 RF08B.37 SV1.4 ; also sheet 3,5
DIO02: IC43.14(I/O1) IC45.14(I/O1) RF08A.35 RF08B.35 SV1.6 ; also sheet 3,5
DIO03: IC43.13(I/O0) IC45.13(I/O0) RF08A.33 RF08B.33 SV1.8 ; also sheet 3,5
DIO04: IC39.21(I/O7) IC42.21(I/O7) RF08A.24 RF08B.24 SV1.10 ; also sheet 3,5
DIO05: IC39.20(I/O6) IC42.20(I/O6) RF08A.26 RF08B.26 SV1.12 ; also sheet 3,5
DIO06: IC39.19(I/O5) IC42.19(I/O5) RF08A.28 RF08B.28 SV1.14 ; also sheet 3,5
DIO07: IC39.18(I/O4) IC42.18(I/O4) RF08A.30 RF08B.30 SV1.16 ; also sheet 3,5
DIO08: IC39.17(I/O3) IC42.17(I/O3) RF08A.32 RF08B.32 SV1.18 ; also sheet 3,5
DIO09: IC39.15(I/O2) IC42.15(I/O2) RF08A.29 RF08B.29 SV1.20 ; also sheet 3,5
DIO10: IC39.14(I/O1) IC42.14(I/O1) RF08A.27 RF08B.27 SV1.22 ; also sheet 3,5
DIO11: IC39.13(I/O0) IC42.13(I/O0) RF08A.25 RF08B.25 SV1.24 ; also sheet 3,5
DIOEVEN: IC43.18(I/O4) IC45.18(I/O4) RF08A.34 RF08B.34 ; also sheet 3
DMA00: IC39.25(A11) IC42.25(A11) IC43.25(A11) IC45.25(A11) RF08A.16 RF08B.16 SV2.1 SV2.24 ; also sheet 2,3,5
DMA01: IC39.23(A10) IC42.23(A10) IC43.23(A10) IC45.23(A10) RF08A.20 RF08B.20 SV2.3 ; also sheet 2,3,5
DMA02: IC39.26(A9) IC42.26(A9) IC43.26(A9) IC45.26(A9) RF08A.14 RF08B.14 SV2.5 ; also sheet 2,3,5
DMA03: IC39.27(A8) IC42.27(A8) IC43.27(A8) IC45.27(A8) RF08A.12 RF08B.12 SV2.7 ; also sheet 2,3,5
DMA04: IC39.5(A7) IC42.5(A7) IC43.5(A7) IC45.5(A7) RF08A.9 RF08B.9 SV2.9 ; also sheet 2,3,5
DMA05: IC39.6(A6) IC42.6(A6) IC43.6(A6) IC45.6(A6) RF08A.11 RF08B.11 SV2.11 ; also sheet 2,3,5
DMA06: IC39.7(A5) IC42.7(A5) IC43.7(A5) IC45.7(A5) RF08A.13 RF08B.13 SV2.13 ; also sheet 2,3,5
DMA07: IC39.8(A4) IC42.8(A4) IC43.8(A4) IC45.8(A4) RF08A.15 RF08B.15 SV2.15 ; also sheet 2,3,5
DMA08: IC39.9(A3) IC42.9(A3) IC43.9(A3) IC45.9(A3) RF08A.17 RF08B.17 SV2.17 ; also sheet 2,3,5
DMA09: IC39.10(A2) IC42.10(A2) IC43.10(A2) IC45.10(A2) RF08A.19 RF08B.19 SV2.19 ; also sheet 2,3,5
DMA10: IC39.11(A1) IC42.11(A1) IC43.11(A1) IC45.11(A1) RF08A.21 RF08B.21 SV2.21 ; also sheet 2,3,5
DMA11: IC39.12(A0) IC42.12(A0) IC43.12(A0) IC45.12(A0) RF08A.23 RF08B.23 SV2.23 ; also sheet 2,3,5
DONE: SV1.23 ; also sheet 1,2,5
EIE: SV1.3 ; also sheet 2,5
F.1: SV2.6 ; also sheet 1,2,5
F.2: SV2.4 ; also sheet 1,2,5
F.3: SV2.2 ; also sheet 1,2,5
GND: G1.- G1.-@1(-) G2.- G2.-@1(-) G3.- G3.-@1(-) G4.- G4.-@1(-) IC39.16(VSS) IC42.16(VSS) IC43.16(VSS) IC44.7(P:VSS) IC45.16(VSS) IC46.7(P:VSS) RF08A.31 RF08A.39 RF08B.31 RF08B.39 SV2.25 SV2.26 ; also sheet 1,2,3,5
MEMSUPPLY [Power]: D1.C D2.C D3.C D5.C D6.C D7.C IC39.32(VCC) IC42.32(VCC) IC43.32(VCC) IC44.14(P:VDD) IC45.32(VCC) IC46.14(P:VDD) R3.2 R4.2
N$18: IC44.3(A:O) IC44.5(B:I0) IC44.6(B:I1)
N$35: IC44.1(A:I0) IC44.2(A:I1) JP1.2
N$36: D7.A G4.+ G4.+@1(+) G4.+@2(+) G4.+@3(+) G4.+@4(+)
N$38: IC46.3(A:O) IC46.5(B:I0) IC46.6(B:I1)
N$39: IC46.1(A:I0) IC46.2(A:I1) JP2.2
N$41: D5.A G3.+ G3.+@1(+) G3.+@2(+) G3.+@3(+) G3.+@4(+)
N$130: D3.A G2.+ G2.+@1(+) G2.+@2(+) G2.+@3(+) G2.+@4(+)
N$131: D2.A G1.+ G1.+@1(+) G1.+@2(+) G1.+@3(+) G1.+@4(+)
NXD: SV1.17 ; also sheet 2,5
PER: SV1.21 ; also sheet 2,5
PIE: SV1.5 ; also sheet 2,5
VCC [Power]: D1.A D6.A RF08A.2 RF08B.2 SV1.25 SV1.26 ; also sheet 1,2,3,5
WLS: SV1.15 ; also sheet 2,5
WRITING: IC39.24(!OE) IC42.24(!OE) IC43.24(!OE) IC45.24(!OE) RF08A.18 RF08B.18 SV1.9 ; also sheet 1,3,5
Unconnected: IC43.19(I/O5) IC43.20(I/O6) IC43.21(I/O7) IC44.8(C:I0) IC44.9(C:I1) IC44.10(C:O) IC44.11(D:O) IC44.12(D:I0) IC44.13(D:I1) IC45.19(I/O5) IC45.20(I/O6) IC45.21(I/O7) IC46.8(C:I0) IC46.9(C:I1) IC46.10(C:O) IC46.11(D:O) IC46.12(D:I0) IC46.13(D:I1) SV1.7 SV1.13

### Notes on the sheet
- RS08 Memory for 2 drives | Connector to RF08 | RS08 Memory for 2 drives | Connector to RF08
- Battery backed Memory Supply | Hold CS1\\ High During Powerdown | Battery backed Memory Supply | Hold CS1\\ High During Powerdown

## Sheet 5 of 5
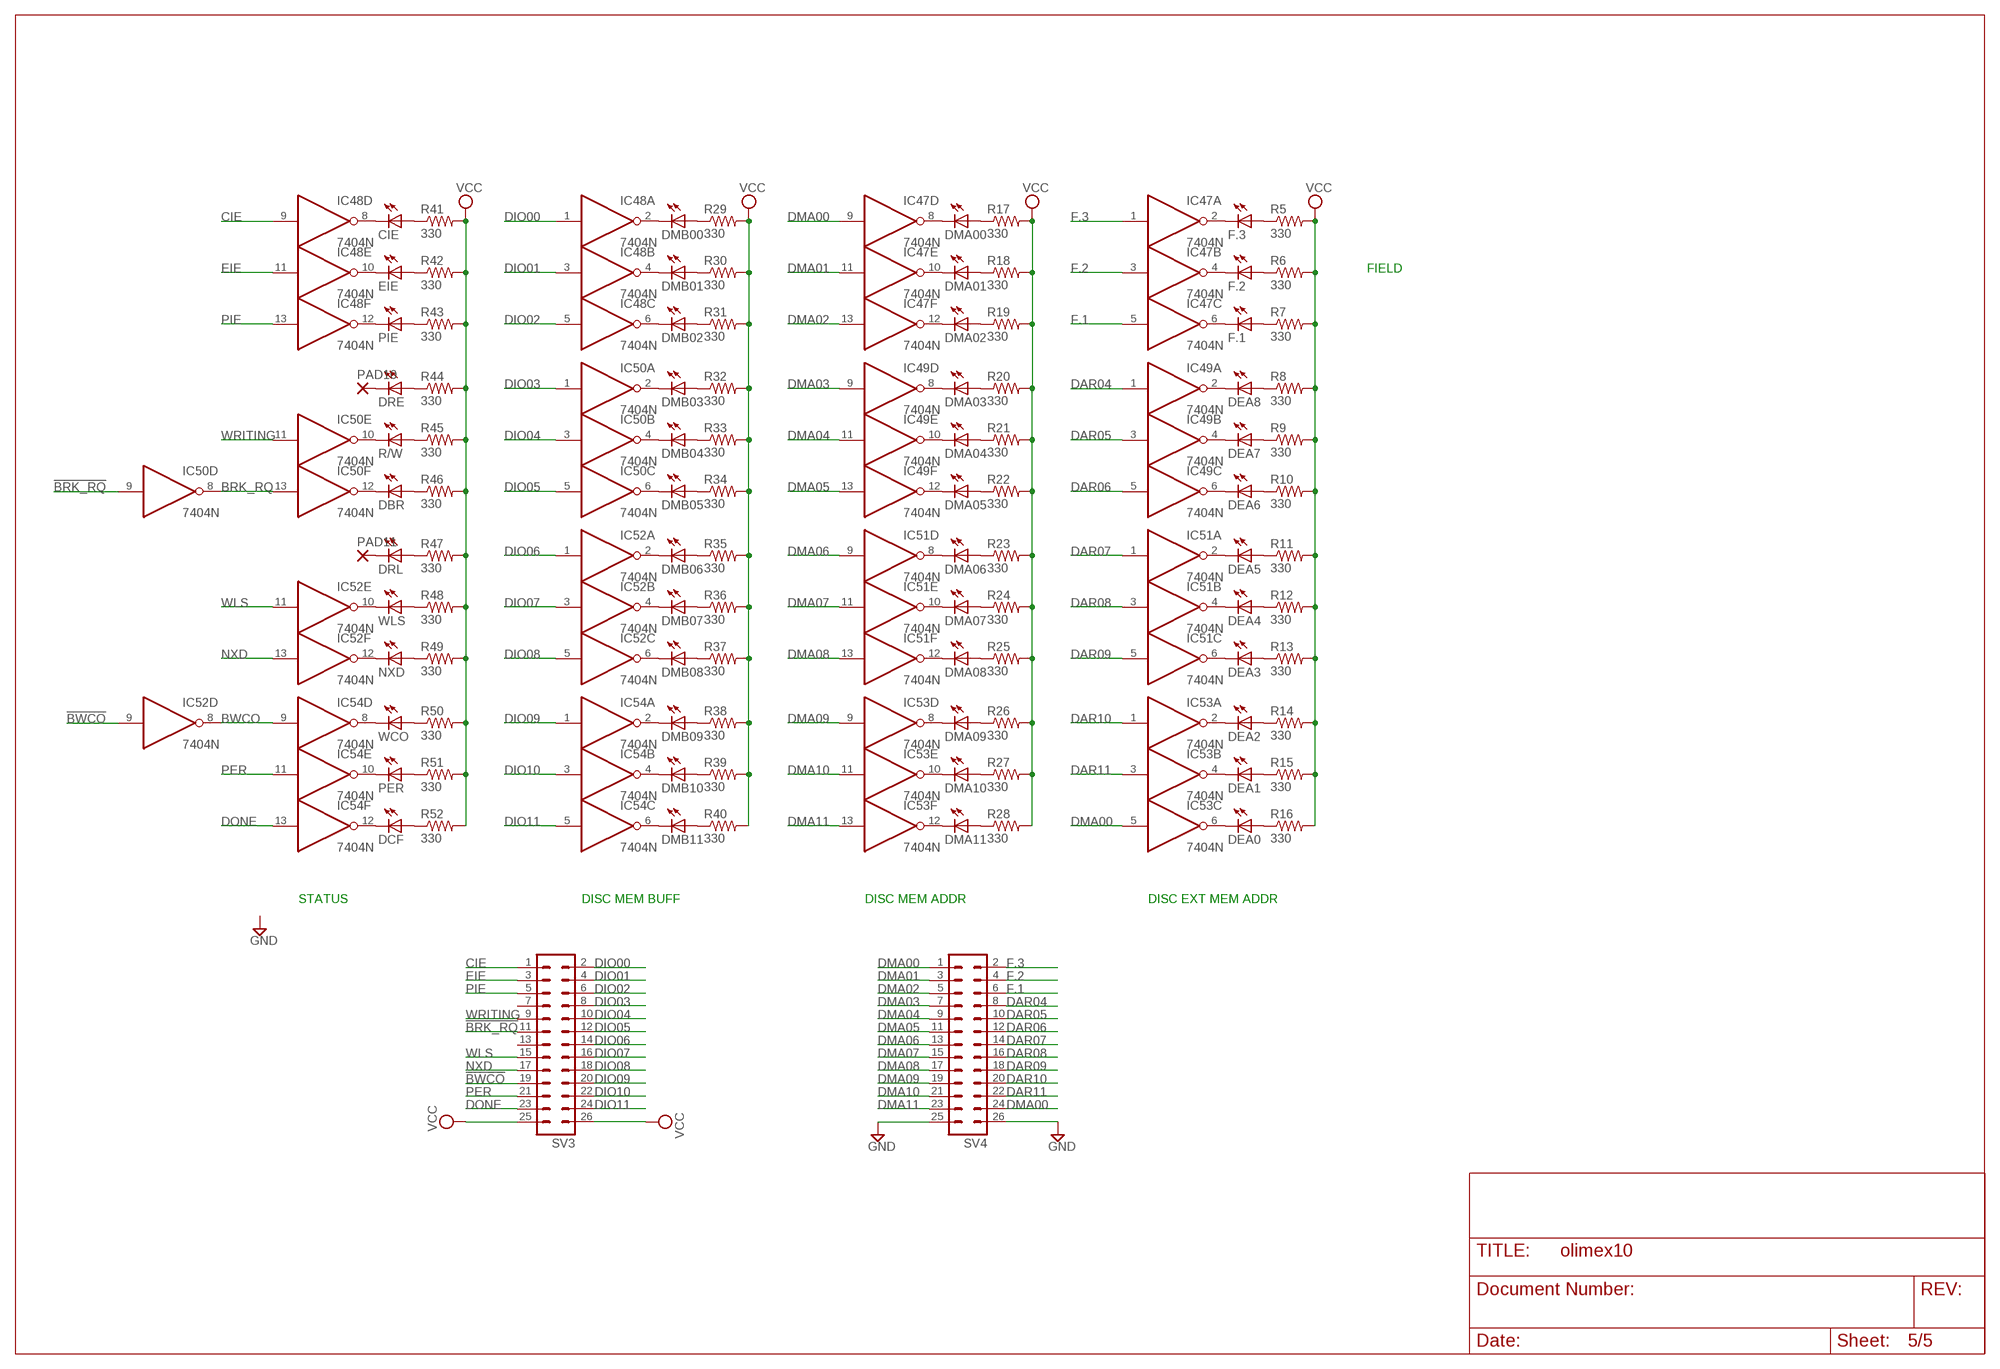
[diagram p4: schematic, sheet 5]

### Parts
CIE  LED5MM  [LED5MM]
DBR  LED5MM  [LED5MM]
DCF  LED5MM  [LED5MM]
DEA0  LED5MM  [LED5MM]
DEA1  LED5MM  [LED5MM]
DEA2  LED5MM  [LED5MM]
DEA3  LED5MM  [LED5MM]
DEA4  LED5MM  [LED5MM]
DEA5  LED5MM  [LED5MM]
DEA6  LED5MM  [LED5MM]
DEA7  LED5MM  [LED5MM]
DEA8  LED5MM  [LED5MM]
DMA00  LED5MM  [LED5MM]
DMA01  LED5MM  [LED5MM]
DMA02  LED5MM  [LED5MM]
DMA03  LED5MM  [LED5MM]
DMA04  LED5MM  [LED5MM]
DMA05  LED5MM  [LED5MM]
DMA06  LED5MM  [LED5MM]
DMA07  LED5MM  [LED5MM]
DMA08  LED5MM  [LED5MM]
DMA09  LED5MM  [LED5MM]
DMA10  LED5MM  [LED5MM]
DMA11  LED5MM  [LED5MM]
DMB00  LED5MM  [LED5MM]
DMB01  LED5MM  [LED5MM]
DMB02  LED5MM  [LED5MM]
DMB03  LED5MM  [LED5MM]
DMB04  LED5MM  [LED5MM]
DMB05  LED5MM  [LED5MM]
DMB06  LED5MM  [LED5MM]
DMB07  LED5MM  [LED5MM]
DMB08  LED5MM  [LED5MM]
DMB09  LED5MM  [LED5MM]
DMB10  LED5MM  [LED5MM]
DMB11  LED5MM  [LED5MM]
DRE  LED5MM  [LED5MM]
DRL  LED5MM  [LED5MM]
EIE  LED5MM  [LED5MM]
F.1  LED5MM  [LED5MM]
F.2  LED5MM  [LED5MM]
F.3  LED5MM  [LED5MM]
IC47  7404N  [DIL14]
IC48  7404N  [DIL14]
IC49  7404N  [DIL14]
IC50  7404N  [DIL14]
IC51  7404N  [DIL14]
IC52  7404N  [DIL14]
IC53  7404N  [DIL14]
IC54  7404N  [DIL14]
NXD  LED5MM  [LED5MM]
PAD10  1,6/0,8  [1,6/0,8]
PAD11  1,6/0,8  [1,6/0,8]
PER  LED5MM  [LED5MM]
PIE  LED5MM  [LED5MM]
R5  330  R-US_0207/10  [0207/10]
R6  330  R-US_0207/10  [0207/10]
R7  330  R-US_0207/10  [0207/10]
R8  330  R-US_0207/10  [0207/10]
R9  330  R-US_0207/10  [0207/10]
R10  330  R-US_0207/10  [0207/10]
R11  330  R-US_0207/10  [0207/10]
R12  330  R-US_0207/10  [0207/10]
R13  330  R-US_0207/10  [0207/10]
R14  330  R-US_0207/10  [0207/10]
R15  330  R-US_0207/10  [0207/10]
R16  330  R-US_0207/10  [0207/10]
R17  330  R-US_0207/10  [0207/10]
R18  330  R-US_0207/10  [0207/10]
R19  330  R-US_0207/10  [0207/10]
R20  330  R-US_0207/10  [0207/10]
R21  330  R-US_0207/10  [0207/10]
R22  330  R-US_0207/10  [0207/10]
R23  330  R-US_0207/10  [0207/10]
R24  330  R-US_0207/10  [0207/10]
R25  330  R-US_0207/10  [0207/10]
R26  330  R-US_0207/10  [0207/10]
R27  330  R-US_0207/10  [0207/10]
R28  330  R-US_0207/10  [0207/10]
R29  330  R-US_0207/10  [0207/10]
R30  330  R-US_0207/10  [0207/10]
R31  330  R-US_0207/10  [0207/10]
R32  330  R-US_0207/10  [0207/10]
R33  330  R-US_0207/10  [0207/10]
R34  330  R-US_0207/10  [0207/10]
R35  330  R-US_0207/10  [0207/10]
R36  330  R-US_0207/10  [0207/10]
R37  330  R-US_0207/10  [0207/10]
R38  330  R-US_0207/10  [0207/10]
R39  330  R-US_0207/10  [0207/10]
R40  330  R-US_0207/10  [0207/10]
R41  330  R-US_0207/10  [0207/10]
R42  330  R-US_0207/10  [0207/10]
R43  330  R-US_0207/10  [0207/10]
R44  330  R-US_0207/10  [0207/10]
R45  330  R-US_0207/10  [0207/10]
R46  330  R-US_0207/10  [0207/10]
R47  330  R-US_0207/10  [0207/10]
R48  330  R-US_0207/10  [0207/10]
R49  330  R-US_0207/10  [0207/10]
R50  330  R-US_0207/10  [0207/10]
R51  330  R-US_0207/10  [0207/10]
R52  330  R-US_0207/10  [0207/10]
R/W  LED5MM  [LED5MM]
SV3  MA13-2  [MA13-2]
SV4  MA13-2  [MA13-2]
WCO  LED5MM  [LED5MM]
WLS  LED5MM  [LED5MM]

### Nets
!BRK_RQ: IC50.9(D:I) SV3.11 ; also sheet 1,4
!BWCO: IC52.9(D:I) SV3.19 ; also sheet 1,4
BRK_RQ: IC50.8(D:O) IC50.13(F:I)
BWCO: IC52.8(D:O) IC54.9(D:I)
CIE: IC48.9(D:I) SV3.1 ; also sheet 2,4
DAR04: IC49.1(A:I) SV4.8 ; also sheet 2,3,4
DAR05: IC49.3(B:I) SV4.10 ; also sheet 2,3,4
DAR06: IC49.5(C:I) SV4.12 ; also sheet 2,3,4
DAR07: IC51.1(A:I) SV4.14 ; also sheet 2,3,4
DAR08: IC51.3(B:I) SV4.16 ; also sheet 2,3,4
DAR09: IC51.5(C:I) SV4.18 ; also sheet 2,3,4
DAR10: IC53.1(A:I) SV4.20 ; also sheet 2,3,4
DAR11: IC53.3(B:I) SV4.22 ; also sheet 2,3,4
DIO00: IC48.1(A:I) SV3.2 ; also sheet 3,4
DIO01: IC48.3(B:I) SV3.4 ; also sheet 3,4
DIO02: IC48.5(C:I) SV3.6 ; also sheet 3,4
DIO03: IC50.1(A:I) SV3.8 ; also sheet 3,4
DIO04: IC50.3(B:I) SV3.10 ; also sheet 3,4
DIO05: IC50.5(C:I) SV3.12 ; also sheet 3,4
DIO06: IC52.1(A:I) SV3.14 ; also sheet 3,4
DIO07: IC52.3(B:I) SV3.16 ; also sheet 3,4
DIO08: IC52.5(C:I) SV3.18 ; also sheet 3,4
DIO09: IC54.1(A:I) SV3.20 ; also sheet 3,4
DIO10: IC54.3(B:I) SV3.22 ; also sheet 3,4
DIO11: IC54.5(C:I) SV3.24 ; also sheet 3,4
DMA00: IC47.9(D:I) IC53.5(C:I) SV4.1 SV4.24 ; also sheet 2,3,4
DMA01: IC47.11(E:I) SV4.3 ; also sheet 2,3,4
DMA02: IC47.13(F:I) SV4.5 ; also sheet 2,3,4
DMA03: IC49.9(D:I) SV4.7 ; also sheet 2,3,4
DMA04: IC49.11(E:I) SV4.9 ; also sheet 2,3,4
DMA05: IC49.13(F:I) SV4.11 ; also sheet 2,3,4
DMA06: IC51.9(D:I) SV4.13 ; also sheet 2,3,4
DMA07: IC51.11(E:I) SV4.15 ; also sheet 2,3,4
DMA08: IC51.13(F:I) SV4.17 ; also sheet 2,3,4
DMA09: IC53.9(D:I) SV4.19 ; also sheet 2,3,4
DMA10: IC53.11(E:I) SV4.21 ; also sheet 2,3,4
DMA11: IC53.13(F:I) SV4.23 ; also sheet 2,3,4
DONE: IC54.13(F:I) SV3.23 ; also sheet 1,2,4
EIE: IC48.11(E:I) SV3.3 ; also sheet 2,4
F.1: IC47.5(C:I) SV4.6 ; also sheet 1,2,4
F.2: IC47.3(B:I) SV4.4 ; also sheet 1,2,4
F.3: IC47.1(A:I) SV4.2 ; also sheet 1,2,4
GND: SV4.25 SV4.26 ; also sheet 1,2,3,4
N$42: F.3.A R5.1
N$43: F.2.A R6.1
N$44: F.1.A R7.1
N$45: DEA8.A R8.1
N$46: DEA7.A R9.1
N$47: DEA6.A R10.1
N$48: DEA5.A R11.1
N$49: DEA4.A R12.1
N$50: DEA3.A R13.1
N$51: DEA2.A R14.1
N$52: DEA1.A R15.1
N$85: DEA0.A R16.1
N$86: DMA00.A R17.1
N$87: DMA01.A R18.1
N$88: DMA02.A R19.1
N$89: DMA03.A R20.1
N$90: DMA04.A R21.1
N$91: DMA05.A R22.1
N$92: DMA06.A R23.1
N$93: DMA07.A R24.1
N$94: DMA08.A R25.1
N$95: DMA09.A R26.1
N$96: DMA10.A R27.1
N$97: DMA11.A R28.1
N$98: DMB00.A R29.1
N$99: DMB01.A R30.1
N$100: DMB02.A R31.1
N$101: DMB03.A R32.1
N$102: DMB04.A R33.1
N$103: DMB05.A R34.1
N$104: DMB06.A R35.1
N$105: DMB07.A R36.1
N$106: DMB08.A R37.1
N$107: DMB09.A R38.1
N$108: DMB10.A R39.1
N$109: DMB11.A R40.1
N$110: CIE.A R41.1
N$111: EIE.A R42.1
N$112: PIE.A R43.1
N$113: DRE.A R44.1
N$114: R45.1 R/W.A
N$115: DBR.A R46.1
N$116: DRL.A R47.1
N$117: R48.1 WLS.A
N$118: NXD.A R49.1
N$119: R50.1 WCO.A
N$120: PER.A R51.1
N$121: DCF.A R52.1
N$122: F.3.K(C) IC47.2(A:O)
N$123: F.2.K(C) IC47.4(B:O)
N$124: F.1.K(C) IC47.6(C:O)
N$125: DMA00.K(C) IC47.8(D:O)
N$126: DMA01.K(C) IC47.10(E:O)
N$127: DMA02.K(C) IC47.12(F:O)
N$128: DMB00.K(C) IC48.2(A:O)
N$129: DMB01.K(C) IC48.4(B:O)
N$132: DMB02.K(C) IC48.6(C:O)
N$133: CIE.K(C) IC48.8(D:O)
N$134: EIE.K(C) IC48.10(E:O)
N$135: IC48.12(F:O) PIE.K(C)
N$136: DEA7.K(C) IC49.4(B:O)
N$137: DEA6.K(C) IC49.6(C:O)
N$138: DMA03.K(C) IC49.8(D:O)
N$139: DMA04.K(C) IC49.10(E:O)
N$140: DMA05.K(C) IC49.12(F:O)
N$141: DMB03.K(C) IC50.2(A:O)
N$142: DMB04.K(C) IC50.4(B:O)
N$143: DMB05.K(C) IC50.6(C:O)
N$144: IC50.10(E:O) R/W.K(C)
N$145: DBR.K(C) IC50.12(F:O)
N$146: DEA5.K(C) IC51.2(A:O)
N$147: DEA4.K(C) IC51.4(B:O)
N$148: DEA3.K(C) IC51.6(C:O)
N$149: DMA06.K(C) IC51.8(D:O)
N$150: DMA07.K(C) IC51.10(E:O)
N$151: DMA08.K(C) IC51.12(F:O)
N$152: DMB06.K(C) IC52.2(A:O)
N$153: DMB07.K(C) IC52.4(B:O)
N$154: DMB08.K(C) IC52.6(C:O)
N$155: IC52.10(E:O) WLS.K(C)
N$156: IC52.12(F:O) NXD.K(C)
N$157: DEA2.K(C) IC53.2(A:O)
N$158: DEA1.K(C) IC53.4(B:O)
N$159: DEA0.K(C) IC53.6(C:O)
N$160: DMA09.K(C) IC53.8(D:O)
N$161: DMA10.K(C) IC53.10(E:O)
N$162: DMA11.K(C) IC53.12(F:O)
N$163: DMB09.K(C) IC54.2(A:O)
N$164: DMB10.K(C) IC54.4(B:O)
N$165: DMB11.K(C) IC54.6(C:O)
N$166: IC54.8(D:O) WCO.K(C)
N$167: IC54.10(E:O) PER.K(C)
N$168: DCF.K(C) IC54.12(F:O)
N$169: DRE.K(C) PAD10.1(P)
N$170: DRL.K(C) PAD11.1(P)
N$171: DEA8.K(C) IC49.2(A:O)
NXD: IC52.13(F:I) SV3.17 ; also sheet 2,4
PER: IC54.11(E:I) SV3.21 ; also sheet 2,4
PIE: IC48.13(F:I) SV3.5 ; also sheet 2,4
VCC [Power]: R5.2 R6.2 R7.2 R8.2 R9.2 R10.2 R11.2 R12.2 R13.2 R14.2 R15.2 R16.2 R17.2 R18.2 R19.2 R20.2 R21.2 R22.2 R23.2 R24.2 R25.2 R26.2 R27.2 R28.2 R29.2 R30.2 R31.2 R32.2 R33.2 R34.2 R35.2 R36.2 R37.2 R38.2 R39.2 R40.2 R41.2 R42.2 R43.2 R44.2 R45.2 R46.2 R47.2 R48.2 R49.2 R50.2 R51.2 R52.2 SV3.25 SV3.26 ; also sheet 1,2,3,4
WLS: IC52.11(E:I) SV3.15 ; also sheet 2,4
WRITING: IC50.11(E:I) SV3.9 ; also sheet 1,3,4
Unconnected: SV3.7 SV3.13

### Notes on the sheet
- FIELD
- STATUS | DISC MEM BUFF | DISC MEM ADDR | DISC EXT MEM ADDR

## Power pins joined to a net without a drawn wire
GND: DAR4-7.8(GND) DAR8-11.8(GND) DMA0-3.8(GND) DMA4-7.8(GND) DMA8-11.8(GND) FIELD.8(GND) IC1.8(GND) IC2.8(GND) IC3.8(GND) IC4.8(GND) IC5.7(P:GND) IC6.8(P:GND) IC7.8(P:GND) IC9.7(P:GND) IC10.7(P:GND) IC11.7(P:GND) IC12.7(P:GND) IC13.7(GND) IC14.7(GND) IC15.7(GND) IC16.8(P:GND) IC17.8(P:GND) IC18.7(P:GND) IC19.7(P:GND) IC20.10(P:GND) IC21.8(P:GND) IC22.7(P:GND) IC23.7(P:GND) IC24.10(P:GND) IC25.8(GND) IC26.10(P:GND) IC28.10(P:GND) IC29.8(GND) IC30.10(P:GND) IC31.10(P:GND) IC32.8(GND) IC33.8(P:GND) IC34.10(P:GND) IC35.10(P:GND) IC36.8(GND) IC37.10(P:GND) IC38.10(P:GND) IC41.8(P:GND) IC47.7(P:GND) IC48.7(P:GND) IC49.7(P:GND) IC50.7(P:GND) IC51.7(P:GND) IC52.7(P:GND) IC53.7(P:GND) IC54.7(P:GND) IC55.7(P:GND) INTENB.8(GND)
VCC: DAR4-7.16(VCC) DAR8-11.16(VCC) DMA0-3.16(VCC) DMA4-7.16(VCC) DMA8-11.16(VCC) FIELD.16(VCC) IC1.16(VCC) IC2.16(VCC) IC3.16(VCC) IC4.16(VCC) IC5.14(P:VCC) IC6.16(P:VCC) IC7.16(P:VCC) IC9.14(P:VCC) IC10.14(P:VCC) IC11.14(P:VCC) IC12.14(P:VCC) IC13.14(VCC) IC14.14(VCC) IC15.14(VCC) IC16.16(P:VCC) IC17.16(P:VCC) IC18.14(P:VCC) IC19.14(P:VCC) IC20.20(P:VCC) IC21.16(P:VCC) IC22.14(P:VCC) IC23.14(P:VCC) IC24.20(P:VCC) IC25.16(VCC) IC26.20(P:VCC) IC28.20(P:VCC) IC29.16(VCC) IC30.20(P:VCC) IC31.20(P:VCC) IC32.16(VCC) IC33.16(P:VCC) IC34.20(P:VCC) IC35.20(P:VCC) IC36.16(VCC) IC37.20(P:VCC) IC38.20(P:VCC) IC41.16(P:VCC) IC47.14(P:VCC) IC48.14(P:VCC) IC49.14(P:VCC) IC50.14(P:VCC) IC51.14(P:VCC) IC52.14(P:VCC) IC53.14(P:VCC) IC54.14(P:VCC) IC55.14(P:VCC) INTENB.16(VCC)

## Library data of the parts
C1-C44 C46-C48 = rcl:C-US: CAPACITOR, American symbol
C35L C36L D34L D35L D36L RF08A RF08B RS08 = con-lstb:MA20-2: PIN HEADER; OC_FARNELL: unknown; OC_NEWARK: unknown
C45 = rcl:CPOL-US: POLARIZED CAPACITOR, American symbol
CIE DBR DCF DEA0 DEA1-DEA8 DMA00 DMA01-DMA09 DMA10 DMA11 DMB00 DMB01-DMB09 DMB10 DMB11 DRE DRL EIE F.1-F.3 NXD PER PIE R/W WCO WLS = led:LED: LED OSRAM: - CHIPLED LG R971, LG N971, LY N971, LG Q971, LY Q971, LO R971, LY R971 LH N974, LH R974 LS Q976, LO Q976, LY Q976 LO Q996 - Hyper CHIPLED LW Q18S LB Q993, LB Q99A, LB R99A - SideLED LS A670, LO A670, LY A670, LG A670, LP A670 LB A673, LV A673, LT A673, LW A673 LH A674 LY A675 LS A676, LA A676, LO A676, LY A676, LW A676 LS A679, LY A679, LG A679 - Hyper Micro SIDELED® LS Y876, LA Y876, LO Y876, LY Y876 LT Y87S - SmartLED LW L88C, LW L88S LB L89C, LB L89S, LG L890 LS L89K, LO L89K, LY L89K LS L896, LA L896, LO L896, LY L896 - TOPLED LS T670, LO T670, LY T670, LG T670, LP T670 LSG T670, LSP T670, LSY T670, LOP T670, LYG T670 LG T671, LOG T671, LSG T671 LB T673, LV T673, LT T673, LW T673 LH T674 LS T676, LA T676, LO T676, LY T676, LB T676, LH T676, LSB T676, LW T676 LB T67C, LV T67C, LT T67C, LS T67K, LO T67K, LY T67K, LW E67C LS E67B, LA E67B, LO E67B, LY E67B, LB E67C, LV E67C, LT E67C LW T67C LS T679, LY T679, LG T679 LS T770, LO T770, LY T770, LG T770, LP T770 LB T773, LV T773, LT T773, LW T773 LH T774 LS E675, LA E675, LY E675, LS T675 LS T776, LA T776, LO T776, LY T776, LB T776 LHGB T686 LT T68C, LB T68C - Hyper Mini TOPLED® LB M676 - Mini TOPLED Santana® LG M470 LS M47K, LO M47K, LY M47K Source: http://www.osram.convergy.de LUXEON: - LUMILED® LXK2-PW12-R00, LXK2-PW12-S00, LXK2-PW14-U00, LXK2-PW14-V00 LXK2-PM12-R00, LXK2-PM12-S00, LXK2-PM14-U00 LXK2-PE12-Q00, LXK2-PE12-R00, LXK2-PE12-S00, LXK2-PE14-T00, LXK2-PE14-U00 LXK2-PB12-K00, LXK2-PB12-L00, LXK2-PB12-M00, LXK2-PB14-N00, LXK2-PB14-P00, LXK2-PB14-Q00 LXK2-PR12-L00, LXK2-PR12-M00, LXK2-PR14-Q00, LXK2-PR14-R00 LXK2-PD12-Q00, LXK2-PD12-R00, LXK2-PD12-S00 LXK2-PH12-R00, LXK2-PH12-S00 LXK2-PL12-P00, LXK2-PL12-Q00, LXK2-PL12-R00 Source: www.luxeon.com KINGBRIGHT: KA-3528ASYC Source: www.kingbright.com
D1-D8 = diode:1N4148: DIODE high speed (Philips)
DAR4-7 DAR8-11 DMA0-3 DMA4-7 DMA8-11 FIELD INTENB = 74xx-us:74*192: Synchronous 4-bit UP/DOWN COUNTER
G1-G4 = battery:B2430UNI: LI BATTERY
IC1-IC4 = 74xx-us:74*151: Data SELECTOR/MULTIPLEXER
IC5 = 74xx-us:74*20: Dual 4-input NAND gate
IC6 IC7 IC16 IC17 IC21 IC33 IC41 = 74xx-us:74*139: Dual 2-line to 4-line DECODER/DEMULTIPLEXER
IC8 = linear:*555: TIMER
IC9-IC11 IC23 = 74xx-us:74*74: Dual D type positive edge triggered FLIP FLOP, preset and clear
IC12 IC18 = 74xx-us:74*00: Quad 2-input NAND gate
IC13-IC15 = 74xx-us:74*180: 9-bit odd/even PARITY GENERATOR/CHECKER
IC19 IC22 = 74xx-us:74*07: Hex BUFFER, open collector high-voltage output
IC20 IC24 IC26 IC30 IC31 IC34 IC37 IC38 = 74xx-us:74*240: Octal BUFFER and LINE DRIVER, 3-state
IC25 IC29 IC32 IC36 = 74xx-us:74*138: 3-line to 8-line DECODER/DEMULTIPLEXER
IC27 = ic-package:DIL20: Dual In Line / Socket
IC28 IC35 = 74xx-us:74*244: Octal BUFFER and LINE DRIVER, 3-state
IC39 IC42 IC43 IC45 = memory-hitachi:628128P: MEMORY; OC_FARNELL: unknown; OC_NEWARK: unknown
IC44 IC46 = 40xx:4011: Quad 2-input NAND
IC47-IC54 = 74xx-us:74*04: Hex INVERTER
IC55 = dec-con:74*38: Quad 2-input NAND gate, open collector output
J2-J14 = jumper:J: Bridge
JP1 JP2 = jumper:JP2E: JUMPER
PAD1-PAD11 = wirepad:1,6/0,8: THROUGH-HOLE PAD
R1-R52 RA RB RL = rcl:R-US_: RESISTOR, American symbol
SV1-SV4 = con-lstb:MA13-2: PIN HEADER; OC_FARNELL: unknown; OC_NEWARK: unknown
SW1-SW4 = special:SW_DIP-8: DIP SWITCH

## Net classes
1 Power: width 0.508 mm